# Altium project Stag12.PrjPcb (part 3 of 3)

## Sheet loom-accumulator.SchDoc
size 594 x 420 mm
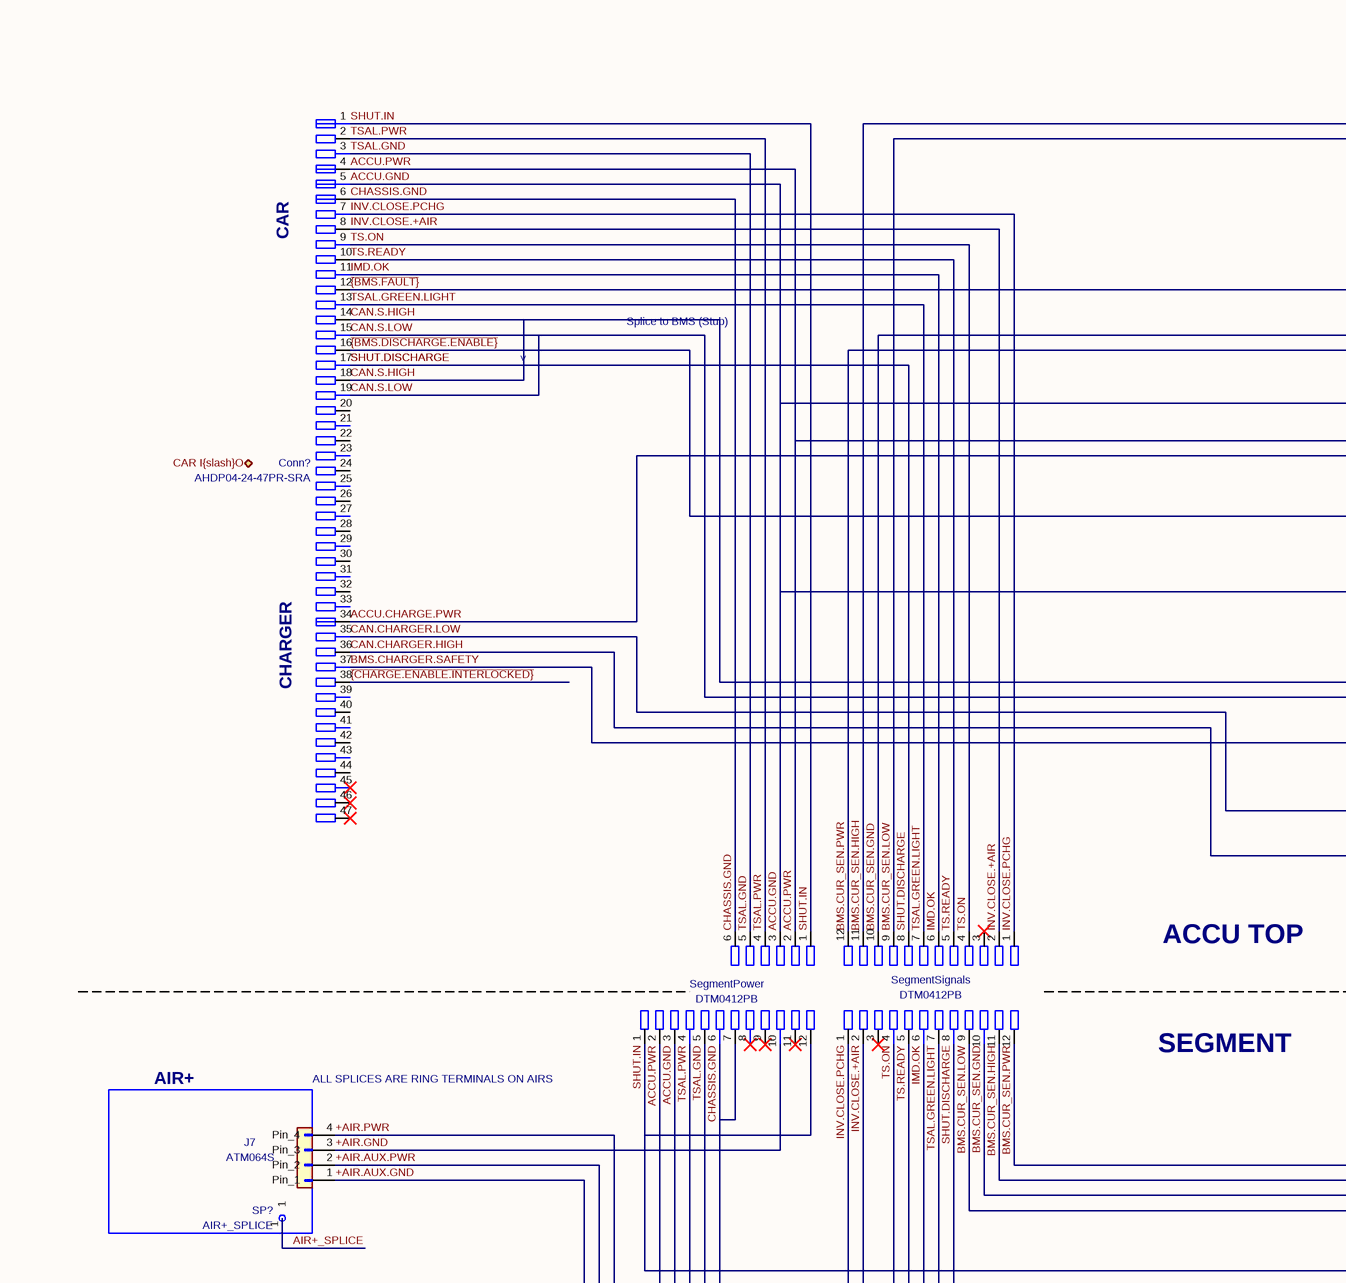
[diagram p44: loom-accumulator.SchDoc, top left]
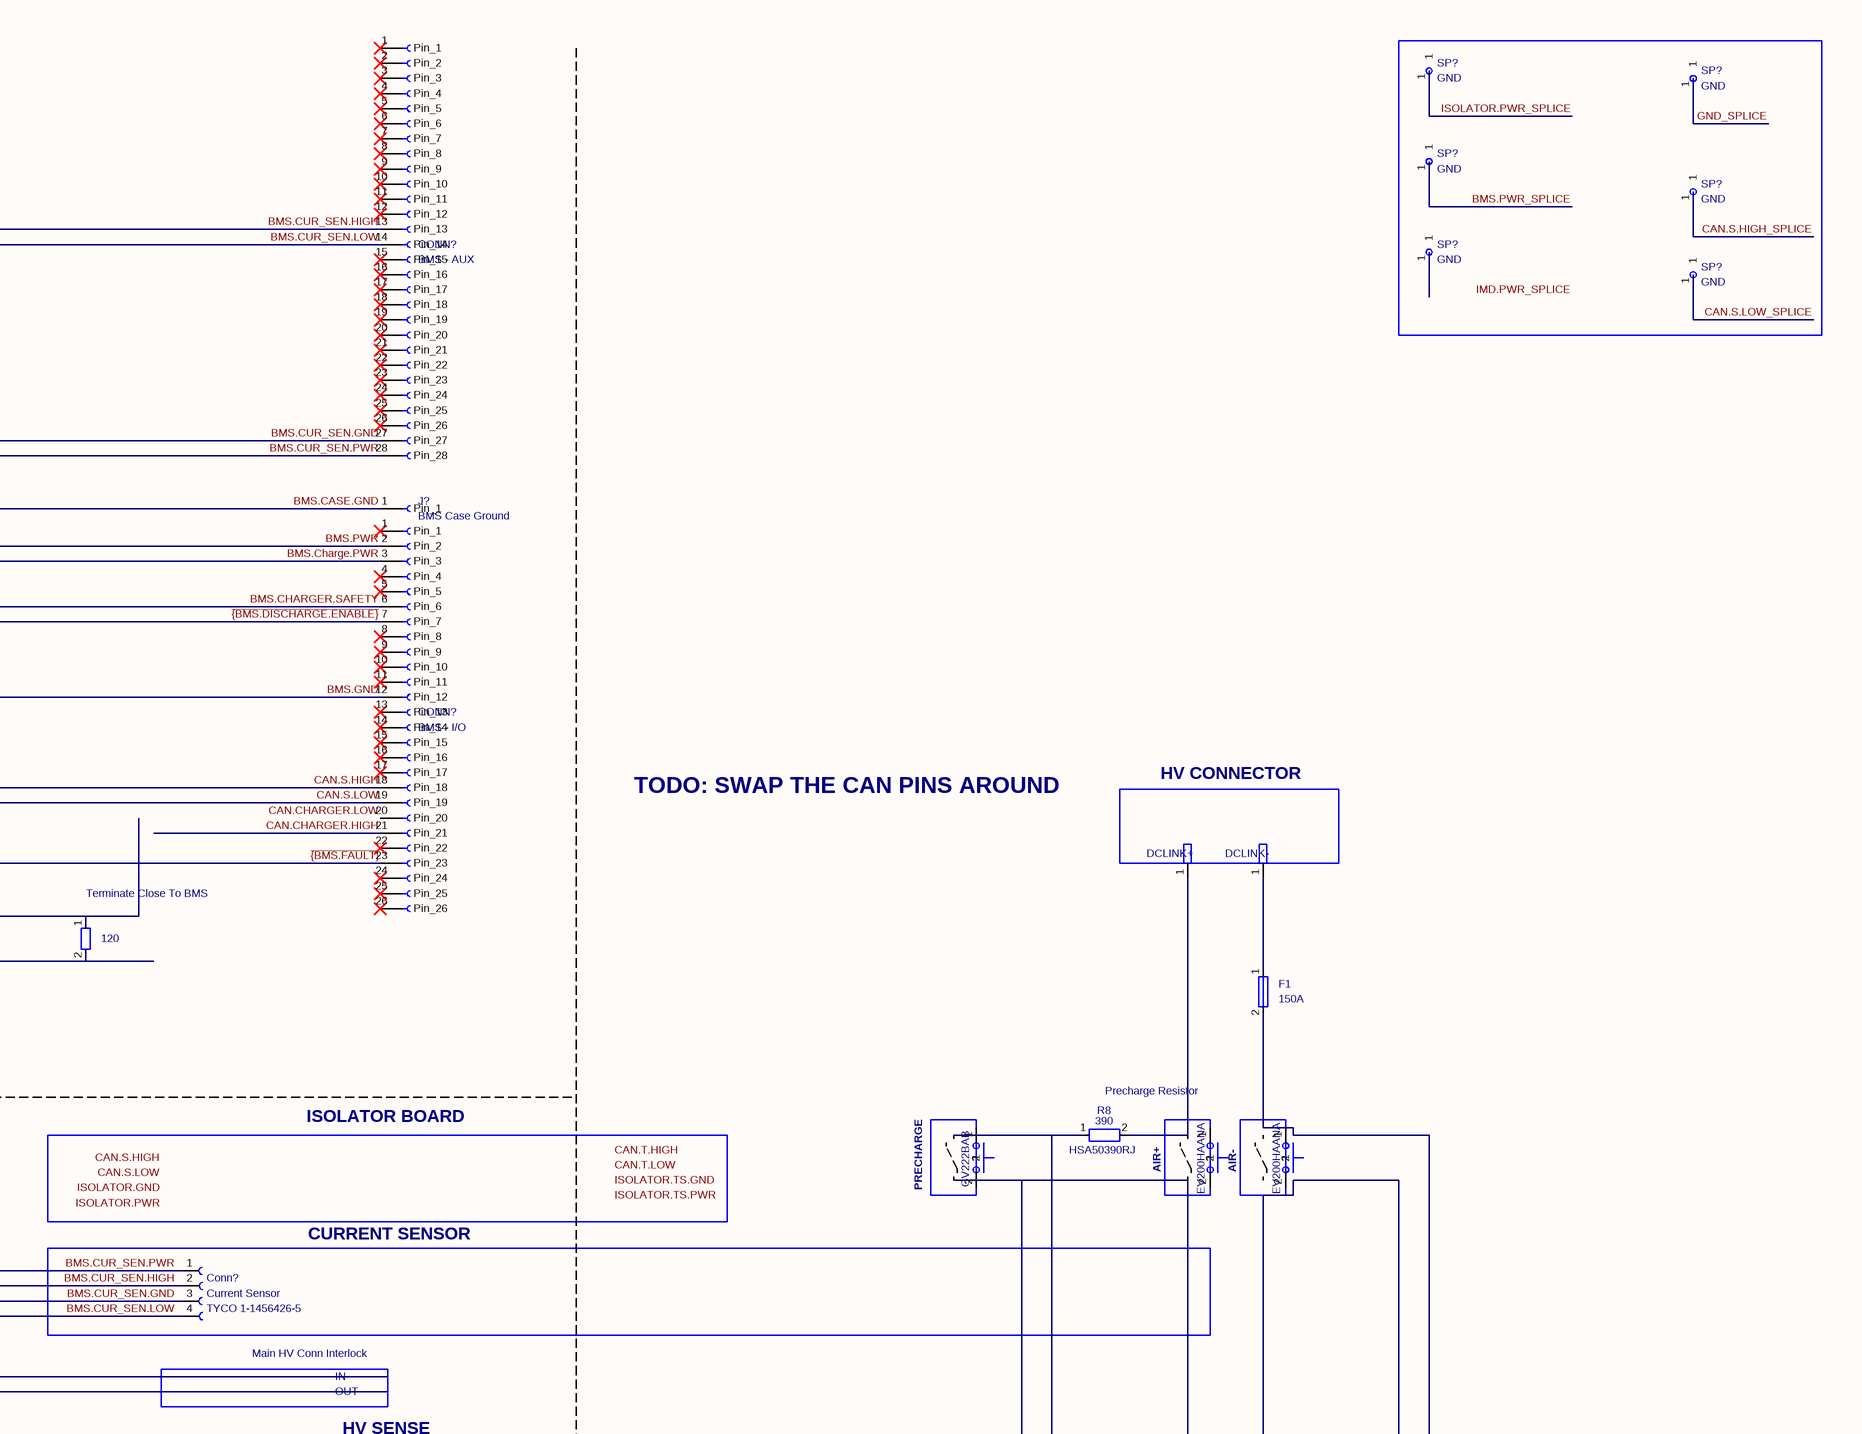
[diagram p45: loom-accumulator.SchDoc, top right]
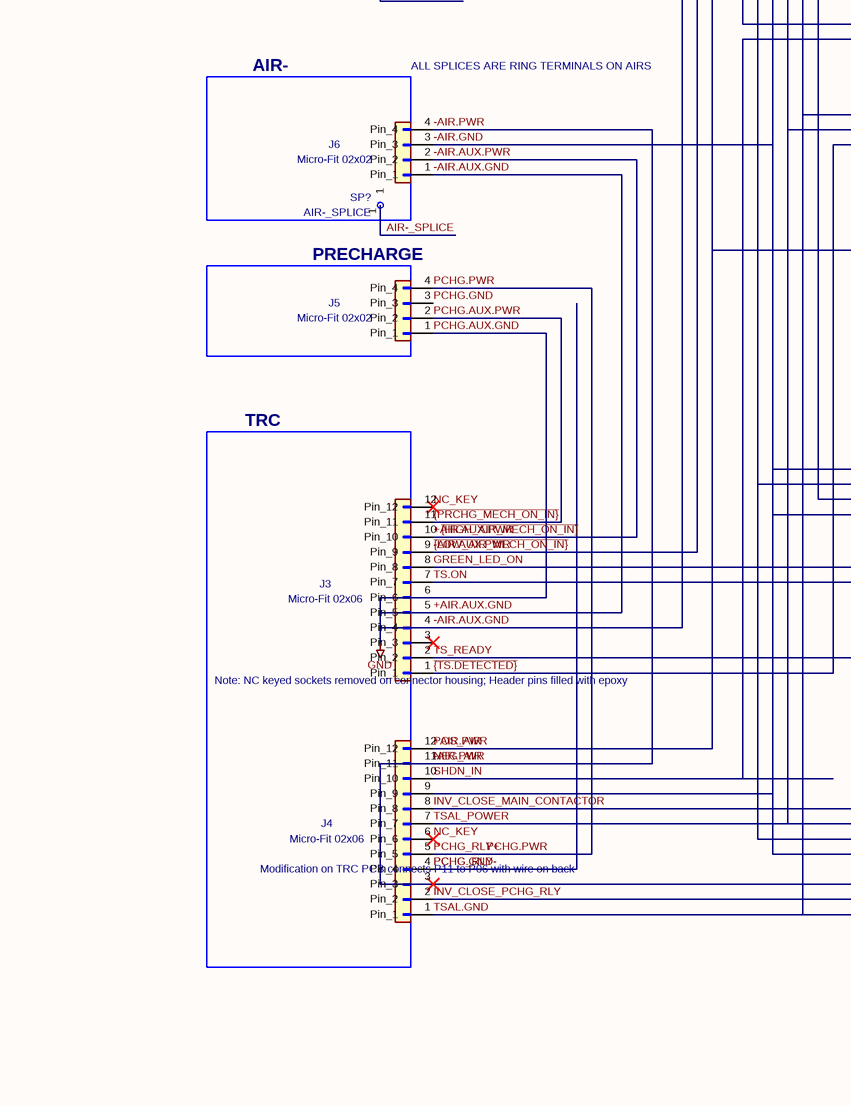
[diagram p46: loom-accumulator.SchDoc, bottom left]
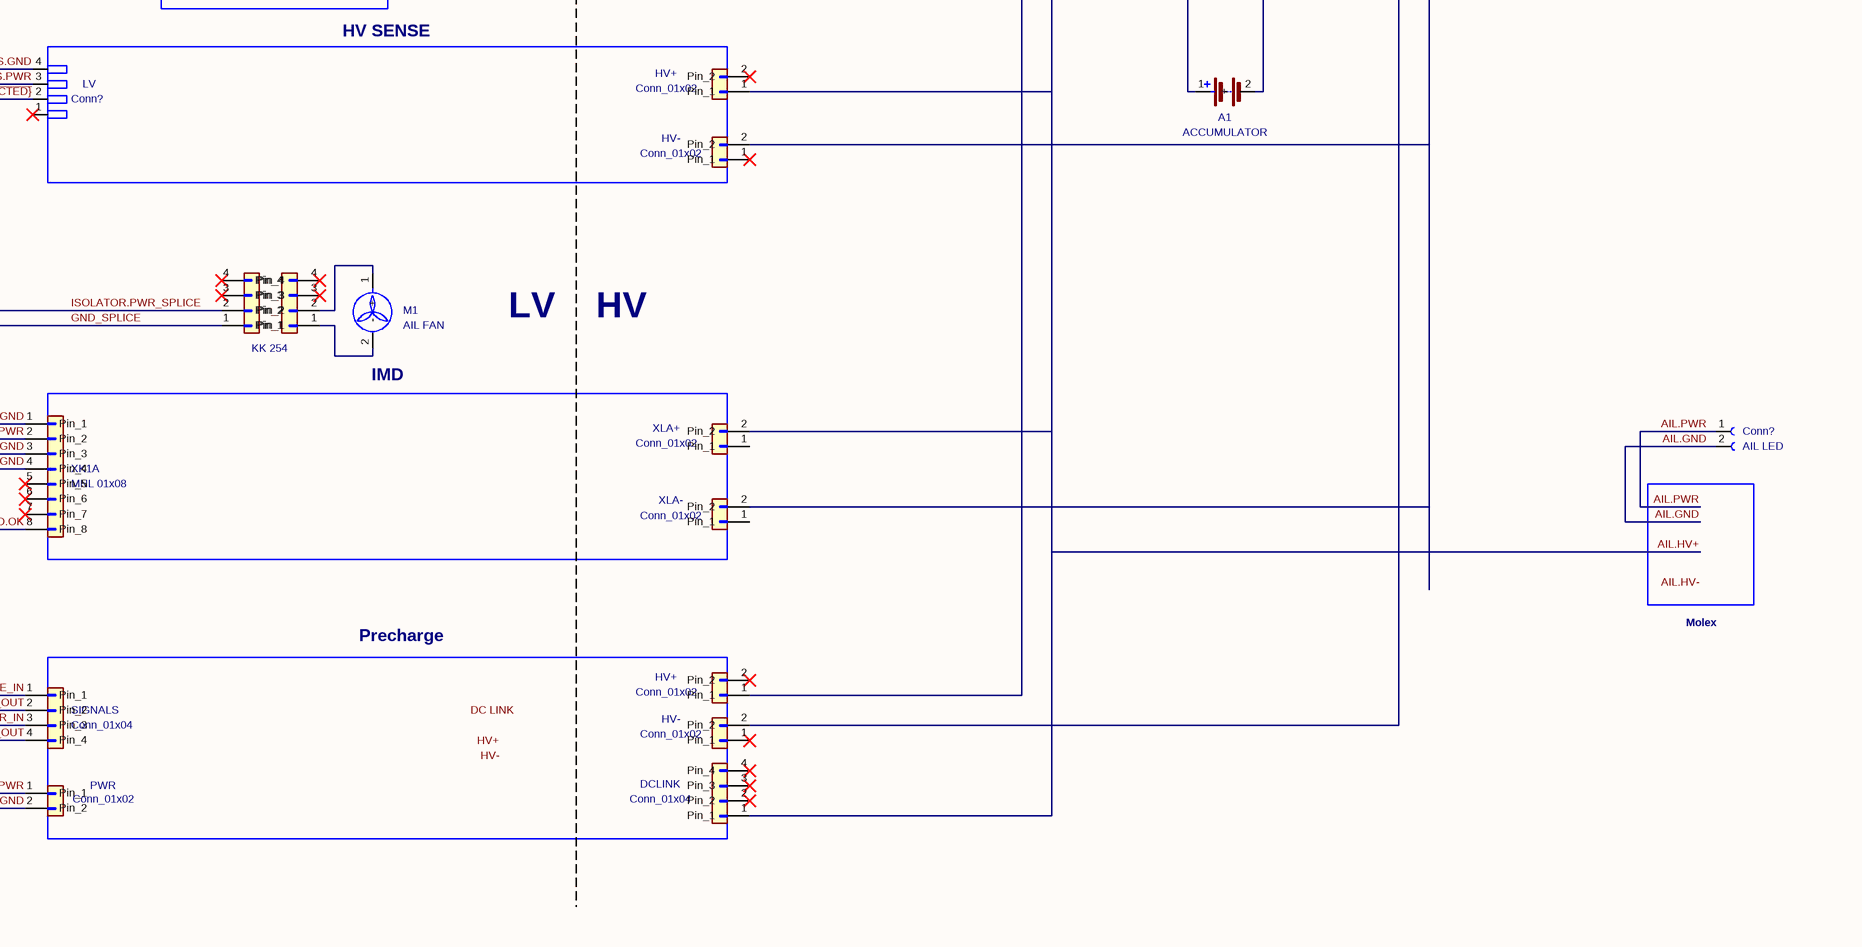
[diagram p47: loom-accumulator.SchDoc, bottom right]

### Parts
(Parts that share a designator on the sheet are numbered #1, #2 ... from top to bottom, then left to right.)
A1  ACCUMULATOR
Conn2  P/N: KK 254  (hidden comment: AIL FAN)
Conn9  Connection Type: DCLINK-  (hidden comment: Banana Plug)
Conn54  AIL FAN  (value not drawn)
Conn?#14  P/N: AHDP04-24-47PR-SRA  (hidden comment: AMPHENOL-47P-Pannel)
CONN?#15  BMS - AUX
CONN?#16  BMS - I/O
Conn?#17  P/N: TYCO 1-1456426-5  (hidden comment: Current Sensor)
Conn?#18  Name: LV  (hidden comment: ~)
Conn?#19  AIL LED
DCLINK  Conn_01x04
DCLINK+  Connection Type: DCLINK+  (hidden comment: Banana Plug)
F1#1  150A
HV+#1  Conn_01x02
HV+#2  Conn_01x02
HV-#1  Conn_01x02
HV-#2  Conn_01x02
J3#2  Micro-Fit 02x06
J4  Micro-Fit 02x06
J5  Micro-Fit 02x02
J6  Micro-Fit 02x02
J7  ATM064S
J?  BMS Case Ground
M1  AIL FAN
PWR  Conn_01x02
R1  120
R8  390  [HSA50390RJ]
SegmentPower  P/N: DTM0412PB  (hidden comment: Deutsch_DTM_12P_Pin)
SegmentPower1  Deutsch_DTM_6P_Pin  (value not drawn)
SegmentSignals  P/N: DTM0412PB  (hidden comment: Deutsch_DTM_12P_Pin)
SegmentSignals1  Deutsch_DTM_12P_Pin  (value not drawn)
SIGNALS  Conn_01x04
SP?#4  GND
SP?#5  GND
SP?#6  GND
SP?#7  GND
SP?#8  GND
SP?#9  GND
SP?#10  AIR+_SPLICE
SP?#11  AIR-_SPLICE
SW7  EV200HAANA
SW8  EV200HAANA
SW9  GV222BAB
XK1A  MNL 01x08
XLA+  Conn_01x02
XLA-  Conn_01x02

### Blocks framed on the sheet
HV CONNECTOR /: Conn9 DCLINK+
AIR+: SP?#10
CURRENT SENSOR /: Conn?#17
AIR-: SP?#11
HV SENSE: Conn?#18
IMD: XK1A
Precharge: PWR SIGNALS

### Ports
CAR I{slash}O (bidir)

### Nets
+AIR.AUX.GND: J3#2.4(Pin_4) J3#2.5(Pin_5) J3#2.6(Pin_6) J5.1(Pin_1) J6.1(Pin_1) J7.1(Pin_1)  [also labelled -AIR.AUX.GND, GND, PCHG.AUX.GND]
+AIR.AUX.PWR: J3#2.9(Pin_9) J3#2.10(Pin_10) J6.2(Pin_2) J7.2(Pin_2)  [also labelled -AIR.AUX.PWR, ~{{HIGH_AIR_MECH_ON_IN}}, ~{{LOW_AIR_MECH_ON_IN}}]
+AIR.GND: Conn2.1(Pin_1) Conn?#14.5 CONN?#16.12(Pin_12) J4.9(Pin_9) J6.3(Pin_3) J7.3(Pin_3) J?.1(Pin_1) PWR.2(Pin_2) SegmentPower.3 SegmentPower.10 SegmentPower1.3 SP?#5.1 XK1A.1(Pin_1) XK1A.4(Pin_4)  [also labelled -AIR.GND, ACCU.GND, BMS.CASE.GND, BMS.GND, GND_SPLICE, IMD.GND, PRECHARGE.GND]
+AIR.PWR: Conn?#14.17 J4.3(Pin_3) J4.11(Pin_11) J4.12(Pin_12) J6.4(Pin_4) J7.4(Pin_4) SegmentSignals.8 SegmentSignals1.8  [also labelled -AIR.PWR, NEG_AIR, POS_AIR, SHUT.DISCHARGE]
ACCU.CHARGE.PWR: Conn?#14.34 CONN?#16.3(Pin_3)  [also labelled BMS.Charge.PWR]
ACCU.PWR: Conn2.2(Pin_2) Conn?#14.4 CONN?#16.2(Pin_2) PWR.1(Pin_1) SegmentPower.2 SegmentPower1.2 SP?#4.1 XK1A.2(Pin_2)  [also labelled BMS.PWR, IMD.PWR, ISOLATOR.PWR_SPLICE, PRECHARGE.PWR]
AIL.GND: Conn?#19.2
AIL.HV+: DCLINK.1(Pin_1) HV+#1.1(Pin_1) R8.1 XLA+.2(Pin_2)
AIL.PWR: Conn?#19.1
AIR+_SPLICE: SP?#10.1
AIR-_SPLICE: SP?#11.1
BMS.CHARGER.SAFETY: Conn?#14.37 CONN?#16.6(Pin_6)
BMS.CUR_SEN.GND: CONN?#15.27(Pin_27) Conn?#17.3 SegmentSignals.10 SegmentSignals1.10
BMS.CUR_SEN.HIGH: CONN?#15.13(Pin_13) Conn?#17.2 SegmentSignals.11 SegmentSignals1.11
BMS.CUR_SEN.LOW: CONN?#15.14(Pin_14) Conn?#17.4 SegmentSignals.9 SegmentSignals1.9
BMS.CUR_SEN.PWR: CONN?#15.28(Pin_28) Conn?#17.1 SegmentSignals.12 SegmentSignals1.12
BMS.PWR_SPLICE: SP?#6.1
CAN.CHARGER.HIGH: Conn?#14.36 CONN?#16.21(Pin_21) R1.2
CAN.CHARGER.LOW: Conn?#14.35 CONN?#16.20(Pin_20) R1.1
CAN.S.HIGH: Conn?#14.14 Conn?#14.18 CONN?#16.18(Pin_18)
CAN.S.HIGH_SPLICE: SP?#7.1
CAN.S.LOW: Conn?#14.15 Conn?#14.19 CONN?#16.19(Pin_19)
CAN.S.LOW_SPLICE: SP?#9.1
CHASSIS.GND: Conn?#14.6 SegmentPower.6 SegmentPower.7 SegmentPower1.6 XK1A.3(Pin_3)
CLOSE_HIGH_AIR_IN: Conn?#14.8 SegmentSignals.2 SegmentSignals1.2 SIGNALS.3(Pin_3)  [also labelled INV.CLOSE.+AIR]
CLOSE_HIGH_AIR_OUT: J4.8(Pin_8) SIGNALS.4(Pin_4)  [also labelled INV_CLOSE_MAIN_CONTACTOR]
CLOSE_PRECHARGE_IN: Conn?#14.7 J4.2(Pin_2) SegmentSignals.1 SegmentSignals1.1 SIGNALS.1(Pin_1) SIGNALS.2(Pin_2)  [also labelled CLOSE_PRECHARGE_OUT, INV.CLOSE.PCHG, INV_CLOSE_PCHG_RLY]
GREEN_LED_ON: Conn?#14.13 J3#2.8(Pin_8) SegmentSignals.7 SegmentSignals1.7  [also labelled TSAL.GREEN.LIGHT]
IMD.OK: Conn?#14.11 SegmentSignals.6 SegmentSignals1.6 XK1A.8(Pin_8)
NC_KEY: J3#2.12(Pin_12) J4.6(Pin_6)
PCHG.AUX.PWR: J3#2.11(Pin_11) J5.2(Pin_2)  [also labelled ~{{PRCHG_MECH_ON_IN}}]
PCHG.GND: J4.4(Pin_4) J5.3(Pin_3)  [also labelled PCHG_RLY-]
PCHG.PWR: J4.5(Pin_5) J5.4(Pin_4)  [also labelled PCHG_RLY+]
SHDN_IN: J4.10(Pin_10)
SHUT.IN: Conn?#14.1 SegmentPower.1 SegmentPower.12 SegmentPower1.1
TS.ON: Conn?#14.9 J3#2.7(Pin_7) SegmentSignals.4 SegmentSignals1.4
TS.READY: Conn?#14.10 J3#2.2(Pin_2) SegmentSignals.5 SegmentSignals1.5  [also labelled TS_READY]
TSAC.HVS.GND: Conn?#14.3 Conn?#18.4 J4.1(Pin_1) SegmentPower.5 SegmentPower1.5  [also labelled TSAL.GND]
TSAC.HVS.PWR: Conn?#14.2 Conn?#18.3 J4.7(Pin_7) SegmentPower.4 SegmentPower1.4  [also labelled TSAL.PWR, TSAL_POWER]
~{{BMS.DISCHARGE.ENABLE}}: Conn?#14.16 CONN?#16.7(Pin_7)
~{{BMS.FAULT}}: Conn?#14.12 CONN?#16.23(Pin_23)
~{{CHARGE.ENABLE.INTERLOCKED}}: Conn?#14.38
~{{TS.DETECTED}}: Conn?#18.2 J3#2.1(Pin_1)
NetA1_1: A1.1(+) HV+#2.1(Pin_1)
NetA1_2: A1.2(-) HV-#2.2(Pin_2)
NetConn9_1: Conn9.1 F1#1.1
NetConn54_1: Conn54.1(Pin_1) M1.2(-)
NetConn54_2: Conn54.2(Pin_2) M1.1(+)
NetDCLINK+_1: DCLINK+.1 R8.2
NetF1#1_2: F1#1.2 HV-#1.2(Pin_2) SW8.1 XLA-.2(Pin_2)

Not connected (* = marked no-connect by the designer): Conn2 3(Pin_3)* 4(Pin_4)*; Conn54 3(Pin_3)* 4(Pin_4)*; Conn?#14 20 21 22 23 24 25 26 27 28 29 30 31 32 33 39 40 41 42 43 44 45* 46* 47*; CONN?#15 1(Pin_1)* 2(Pin_2)* 3(Pin_3)* 4(Pin_4)* 5(Pin_5)* 6(Pin_6)* 7(Pin_7)* 8(Pin_8)* 9(Pin_9)* 10(Pin_10)* 11(Pin_11)* 12(Pin_12)* 15(Pin_15)* 16(Pin_16)* 17(Pin_17)* 18(Pin_18)* 19(Pin_19)* 20(Pin_20)* 21(Pin_21)* 22(Pin_22)* 23(Pin_23)* 24(Pin_24)* 25(Pin_25)* 26(Pin_26)*; CONN?#16 1(Pin_1)* 4(Pin_4)* 5(Pin_5)* 8(Pin_8)* 9(Pin_9)* 10(Pin_10)* 11(Pin_11)* 13(Pin_13)* 14(Pin_14)* 15(Pin_15)* 16(Pin_16)* 17(Pin_17)* 22(Pin_22)* 24(Pin_24)* 25(Pin_25)* 26(Pin_26)*; Conn?#18 1*; DCLINK 2(Pin_2)* 3(Pin_3)* 4(Pin_4)*; HV+#1 2(Pin_2)*; HV+#2 2(Pin_2)*; HV-#1 1(Pin_1)*; HV-#2 1(Pin_1)*; J3#2 3(Pin_3)*; SegmentPower 8* 9* 11*; SegmentSignals 3*; SegmentSignals1 3*; SP?#8 1; SW7 1 2; SW8 2; SW9 1 2; XK1A 5(Pin_5)* 6(Pin_6)* 7(Pin_7)*; XLA+ 1(Pin_1); XLA- 1(Pin_1)

### Notes on the sheet
- (near Conn?#14) CAR
- <--
- Splice to BMS (Stub)
- (near Conn?#14) CHARGER
- TODO: SWAP THE CAN PINS AROUND
- (near R1) Terminate Close
  To BMS
- ACCU TOP
- SEGMENT
- ISOLATOR BOARD
- Precharge Resistor
- (near J7) ALL SPLICES ARE RING
  TERMINALS ON AIRS
- (near SW9) PRECHARGE
- AIR+
- (near SW7) AIR-
- Main HV Conn Interlock
- IN
- OUT
- (near J6) ALL SPLICES ARE RING
  TERMINALS ON AIRS
- PRECHARGE
- LV
- HV
- TRC
- (near J3#2) Note: NC keyed sockets
  removed on connector housing;
  Header pins filled with epoxy
- Molex
- (near J4) Modification on
  TRC PCB connects
  P11 to P06 with
  wire on back
- Labels drawn without touching a wire or pin: AIL.HV-, CAN.S.HIGH, CAN.S.LOW, CAN.T.HIGH, CAN.T.LOW, DC LINK, HV+, HV-, IMD.PWR_SPLICE, ISOLATOR.GND, ISOLATOR.PWR, ISOLATOR.TS.GND, ISOLATOR.TS.PWR
- 1
- 2
- 3
- 4
- 5
- 6
- 7
- 8
- 9
- 10
- 11
- A
- B
- C
- D
- E
- F
- G
- H
- Title: LOOM - ACCUMULATOR
- File: loom-accumulator.kicad_sch
- Sheet: /
- KiCad E.D.A.  kicad (5.1.4)-1
- Size: A2
- Date:
- Rev:
- Id: 1/1

### Library data of the parts
A1 = Battery: Description: Multiple-cell battery; Value: ACCUMULATOR
Conn2 DCLINK J5-J7 SIGNALS = Conn_01x04: Description: Generic connector, single row, 01x04, script generated (kicad-library-utils/schlib/autogen/connector/)
  Conn2: Value: AIL FAN
  DCLINK SIGNALS: Value: Conn_01x04
  J5 J6: Value: Micro-Fit 02x02
  J7: Value: ATM064S
Conn54 = Conn_01x04: Description: Generic connector, single row, 01x04, script generated (kicad-library-utils/schlib/autogen/connector/); P/N: KK 254; Value: AIL FAN
CONN?#15 = Conn_01x28_Socket: Value: BMS - AUX
CONN?#16 = Conn_01x26_Socket: Value: BMS - I/O
Conn?#17 = Current Sensor Connector: Value: Current Sensor
Conn?#18 = Molex_2x2P_Horizontal_1: P/N: 43045-0400; Value: ~
Conn?#19 = Molex_2x1S_Recepticle: P/N: 43645-0200; Value: AIL LED
F1#1 = Fuse: Description: Fuse; Value: 150A
HV+#1 HV+#2 HV-#1 HV-#2 PWR XLA+ XLA- = Conn_01x02: Description: Generic connector, single row, 01x02, script generated (kicad-library-utils/schlib/autogen/connector/); Value: Conn_01x02
J3#2 J4 = Conn_01x12: Description: Generic connector, single row, 01x12, script generated (kicad-library-utils/schlib/autogen/connector/); Value: Micro-Fit 02x06
J? = Conn_01x01_Socket: Description: Generic connector, single row, 01x01, script generated; Value: BMS Case Ground
M1 = Fan: Description: Fan; Value: AIL FAN
R1 = R_Small: Description: Resistor, small symbol; Value: 120
R8 = R: Description: Resistor; Value: 390
SegmentPower1 = Deutsch_DTM_6P_Pin: P/N: DTM046P-E003; Value: Deutsch_DTM_6P_Pin
SegmentSignals1 = Deutsch_DTM_12P_Pin: P/N: DTM0412PB; Value: Deutsch_DTM_12P_Pin
SP?#4-SP?#11 = TestPoint_Small
  SP?#4-SP?#9: Value: GND
  SP?#10: Value: AIR+_SPLICE
  SP?#11: Value: AIR-_SPLICE
SW7-SW9 = SW_Push: Description: Push button switch, generic, two pins
  SW7 SW8: Value: EV200HAANA
  SW9: Value: GV222BAB
XK1A = Conn_01x08: Description: Generic connector, single row, 01x08, script generated (kicad-library-utils/schlib/autogen/connector/); Value: MNL 01x08
Conn9 DCLINK+ = Banana Plug: Value: Banana Plug
Conn?#14 = AMPHENOL-47P-Pannel: Value: AMPHENOL-47P-Pannel
SegmentPower SegmentSignals = Deutsch_DTM_12P_Pin: Value: Deutsch_DTM_12P_Pin

## Sheet pinouts.SchDoc
size 297 x 209 mm
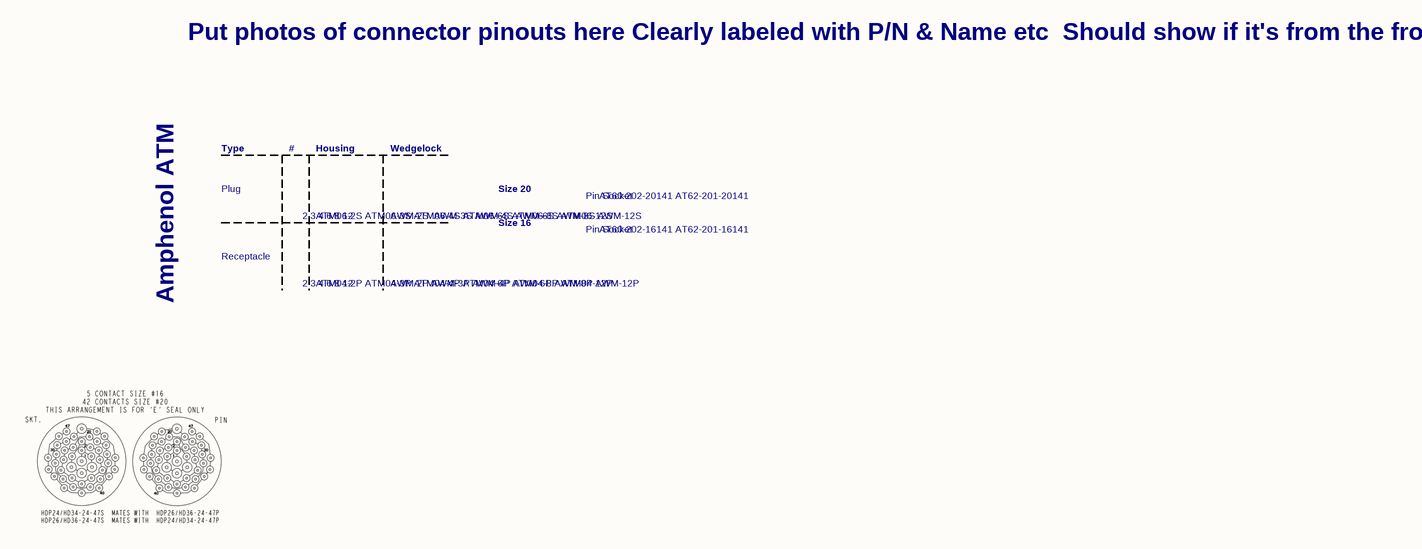
[diagram p48: pinouts.SchDoc]

### Notes on the sheet
- Put photos of connector pinouts here
  Clearly labeled with P/N & Name etc
  Should show if it's from the front or the back
- Type
- #
- Housing
- Wedgelock
- Plug
- 2
  3
  4
  6
  8
  12
- ATM06-2S
  ATM06-3S
  ATM06-4S
  ATM06-6S
  ATM06-8S
  ATM06-12S
- AWM-2S
  AWM-3S
  AWM-4S
  AWM-6S
  AWM-8S
  AWM-12S
- Size 20
- Size 16
- Pin
  Socket
- AT60-202-20141
  AT62-201-20141
- AT60-202-16141
  AT62-201-16141
- Amphenol ATM
- Receptacle
- ATM04-2P
  ATM04-3P
  ATM04-4P
  ATM04-6P
  ATM04-8P
  ATM04-12P
- AWM-2P
  AWM-3P
  AWM-4P
  AWM-6P
  AWM-8P
  AWM-12P
- 1
- 2
- 3
- 4
- 5
- 6
- A
- B
- C
- D
- Title: MISC  - PINOUTS
- File: pinouts.kicad_sch
- Sheet: /
- KiCad E.D.A.  kicad (5.1.4)-1
- Size: A4
- Date:
- Rev:
- Id: 1/1

## Sheet loom-umbilical-box.SchDoc
size 297 x 209 mm
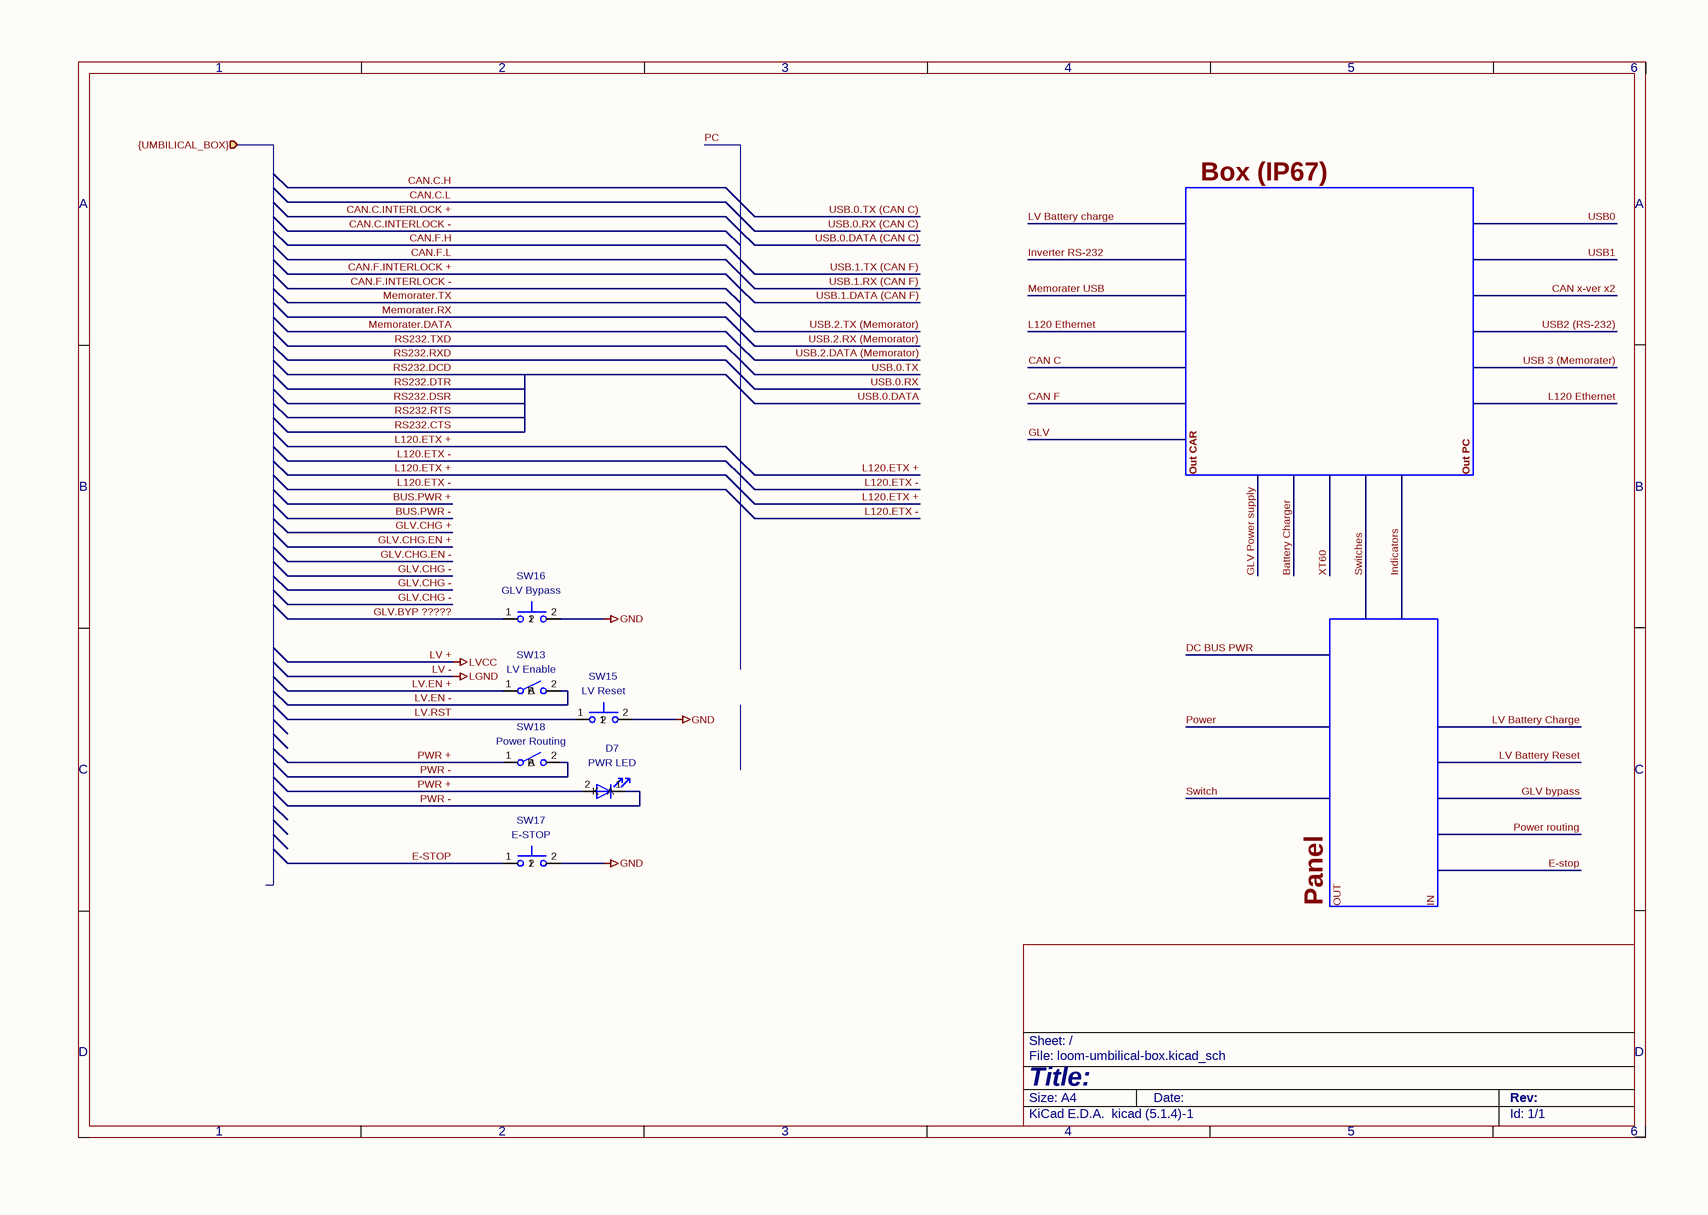
[diagram p49: loom-umbilical-box.SchDoc]

### Parts
(Parts that share a designator on the sheet are numbered #1, #2 ... from top to bottom, then left to right.)
D7  PWR LED
SW13#2  LV Enable
SW15  LV Reset
SW16  GLV Bypass
SW17  E-STOP
SW18  Power Routing

### Ports
{UMBILICAL_BOX} (in)

### Nets
GND: SW15.2 SW16.2 SW17.2  [project net +AIR.AUX.GND]
E-stop: SW17.1
GLV.BYP ?????: SW16.1
LV.EN +: SW13#2.1(A)
LV.EN -: SW13#2.2(B)
LV.RST: SW15.1
PWR +: D7.2(A) SW18.1(A)
PWR -: D7.1(K) SW18.2(B)

### Buses and harness runs
bus PC

### Notes on the sheet
- Labels drawn without touching a wire or pin: Box (IP67), IN, OUT, Out CAR, Out PC, Panel
- 1
- 2
- 3
- 4
- 5
- 6
- A
- B
- C
- D
- Title:
- File: loom-umbilical-box.kicad_sch
- Sheet: /
- KiCad E.D.A.  kicad (5.1.4)-1
- Size: A4
- Date:
- Rev:
- Id: 1/1

### Library data of the parts
D7 = LED: Description: Light emitting diode; Sim.Pins: 1=K 2=A; Value: PWR LED
SW13#2 SW18 = SW_SPST: Description: Single Pole Single Throw (SPST) switch
  SW13#2: Value: LV Enable
  SW18: Value: Power Routing
SW15-SW17 = SW_Push: as SW7-SW9 on sheet loom-accumulator
  SW15: Value: LV Reset
  SW16: Value: GLV Bypass
  SW17: Value: E-STOP

## Sheet device-lvbms.SchDoc
size 297 x 209 mm
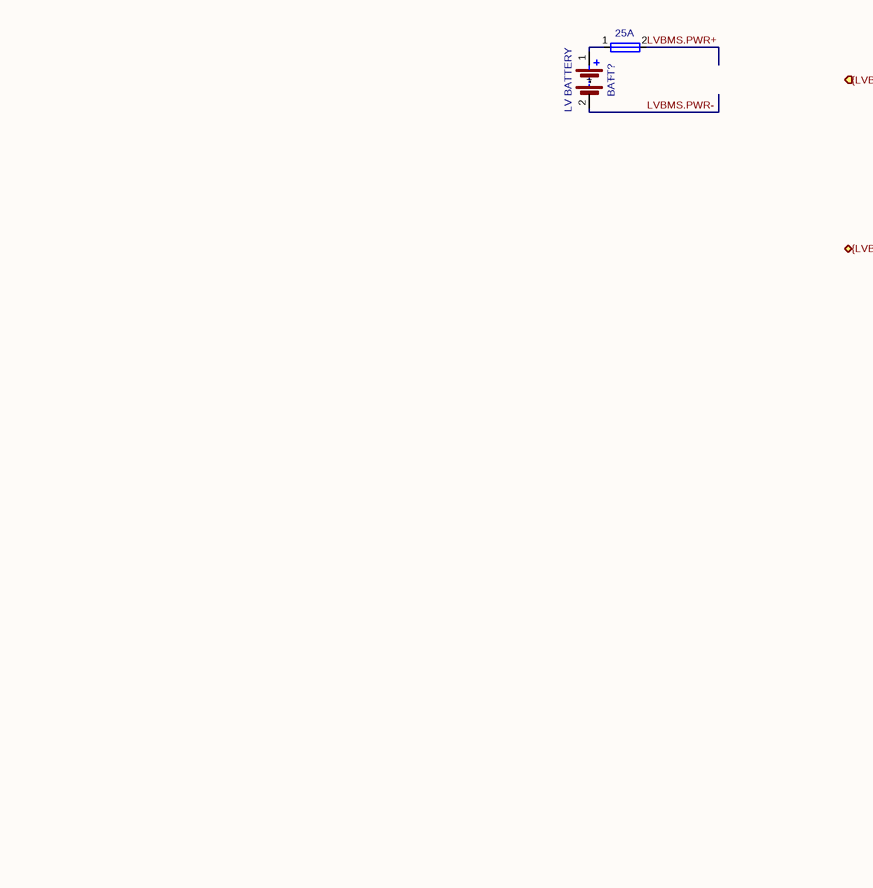
[diagram p50: device-lvbms.SchDoc]

### Parts
BATT?  Conn Name: LV BATTERY  (hidden comment: ~)
F?  25A

### Ports
{LVBMS.DATA} (bidir), {LVBMS.PWR} (in)

### Nets
LVBMS.PWR+: F?.2
LVBMS.PWR-: BATT?.2(-)
NetBATT?_1: BATT?.1(+) F?.1

### Notes on the sheet
- 1
- 2
- 3
- 4
- 5
- 6
- A
- B
- C
- D
- Title:
- File: device-lvbms.kicad_sch
- Sheet: /
- KiCad E.D.A.  kicad (5.1.4)-1
- Size: A4
- Date:
- Rev:
- Id: 1/1

### Library data of the parts
BATT? = Battery: Value: ~
F? = Fuse: Value: 25A

## Sheet loom-pedal-box.SchDoc
size 594 x 420 mm
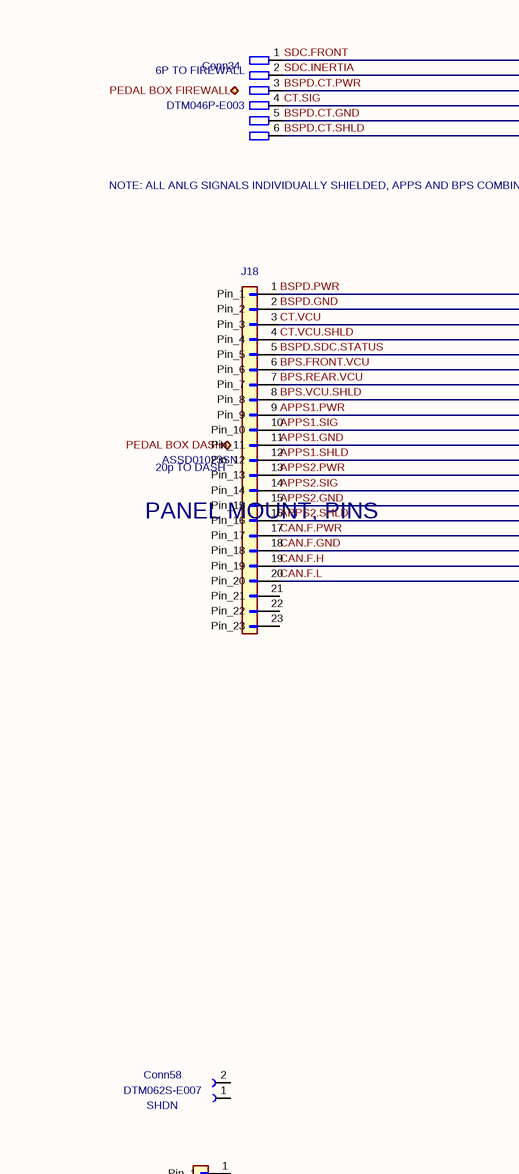
[diagram p51: loom-pedal-box.SchDoc, top left]
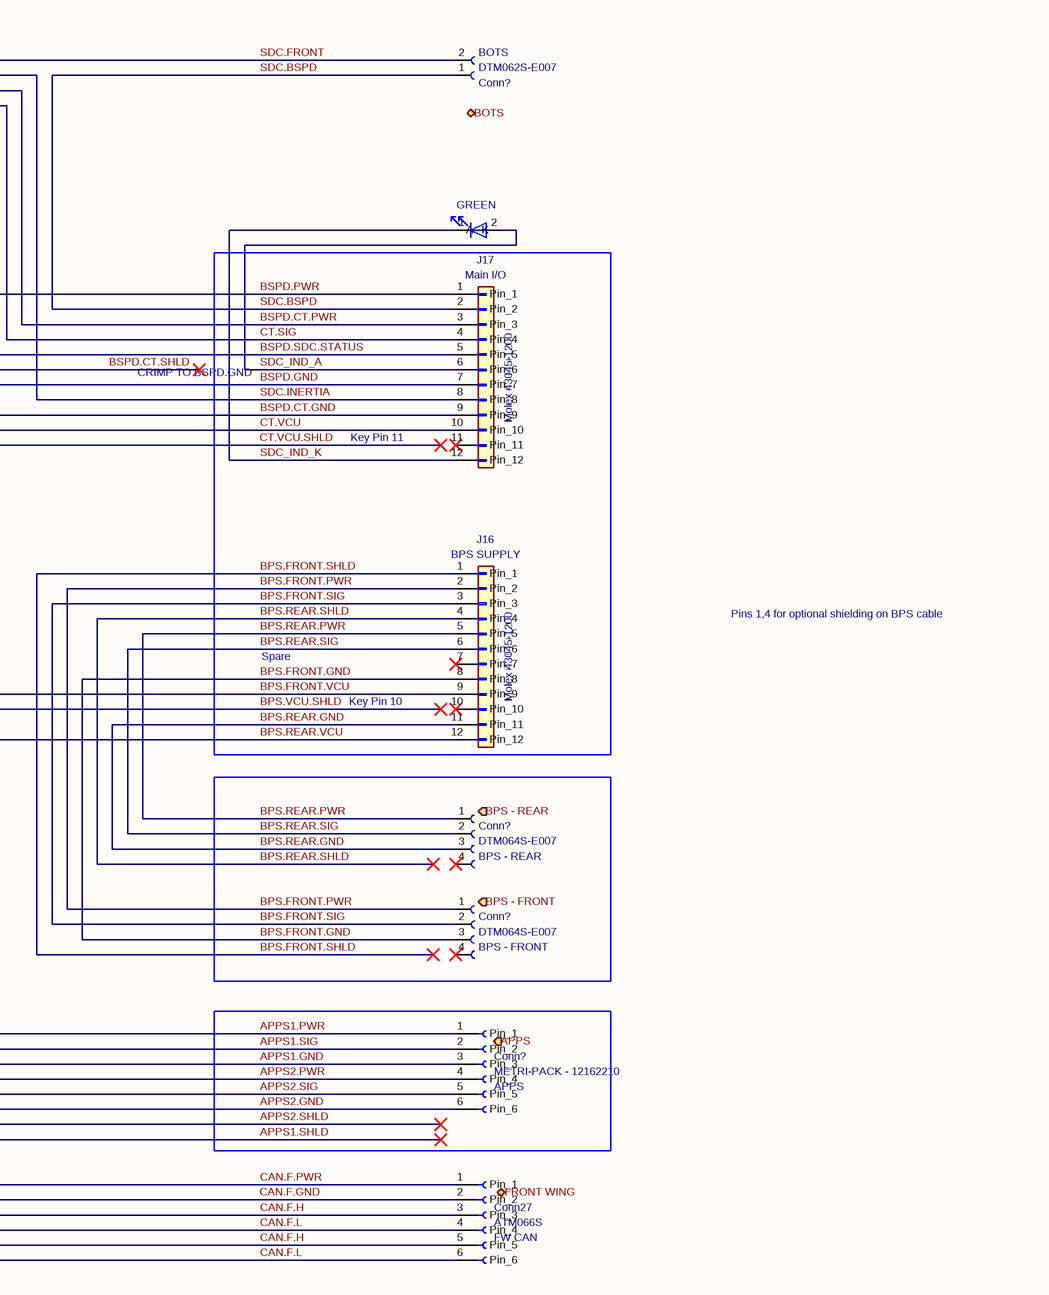
[diagram p52: loom-pedal-box.SchDoc, top right]
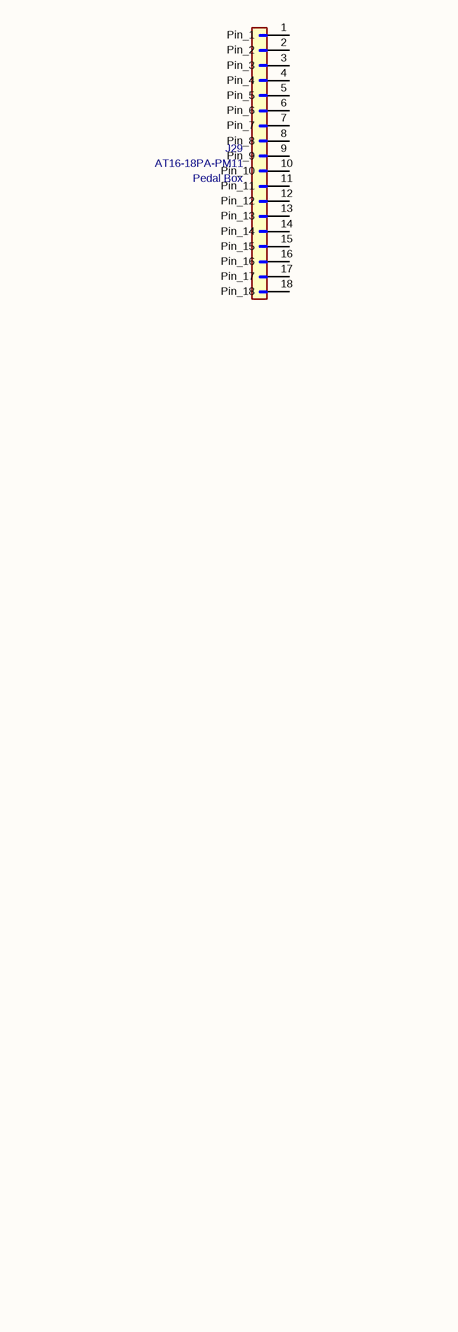
[diagram p53: loom-pedal-box.SchDoc, bottom left]
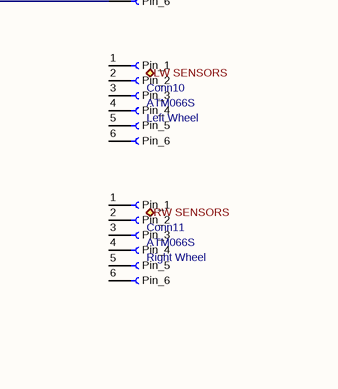
[diagram p54: loom-pedal-box.SchDoc, bottom right]

### Parts
(Parts that share a designator on the sheet are numbered #1, #2 ... from top to bottom, then left to right.)
Conn10  Conn Name: Left Wheel  (hidden comment: ATM066S)
Conn11  Conn Name: Right Wheel  (hidden comment: ATM066S)
Conn27  Conn Name: FW CAN  (hidden comment: ATM066S)
Conn34  P/N: DTM046P-E003  (hidden comment: Deutsch_DTM_6P_Pin)
Conn58  P/N: DTM062S-E007  Conn Name: SHDN  (hidden comment: Deutsch_DTM_2S_Pin)
Conn?#20  P/N: DTM062S-E007  Conn Name: BOTS  (hidden comment: Deutsch_DTM_2S_Pin)
Conn?#21  P/N: DTM064S-E007  Conn Name: BPS - REAR  (hidden comment: Deutsch_DTM_4S_Pin)
Conn?#22  P/N: DTM064S-E007  Conn Name: BPS - FRONT  (hidden comment: Deutsch_DTM_4S_Pin)
Conn?#23  Conn Name: APPS  (hidden comment: METRI-PACK - 12162210)
D6  GREEN
J16  P/N: Molex 43045-1200  [Molex_Micro-Fit_3.0_43045-1200_2x06_P3.00mm_Horizontal]  (hidden comment: BPS SUPPLY)
J17  P/N: Molex 43045-1200  [Molex_Micro-Fit_3.0_43045-1200_2x06_P3.00mm_Horizontal]  (hidden comment: Main I/O)
J18  ASSD01023SN
J29  Conn Name: Pedal Box  (hidden comment: AT16-18PA-PM11)

### Ports
APPS (in), BOTS (bidir), BPS - FRONT (in), BPS - REAR (in), FRONT WING (bidir), LW SENSORS (bidir), PEDAL BOX DASH (bidir), PEDAL BOX FIREWALL (bidir), RW SENSORS (bidir)

### Nets
APPS1.GND: Conn?#23.3(Pin_3) J18.11(Pin_11)
APPS1.PWR: Conn?#23.1(Pin_1) J18.9(Pin_9)
APPS1.SHLD: J18.12(Pin_12)
APPS1.SIG: Conn?#23.2(Pin_2) J18.10(Pin_10)
APPS2.GND: Conn?#23.6(Pin_6) J18.15(Pin_15)
APPS2.PWR: Conn?#23.4(Pin_4) J18.13(Pin_13)
APPS2.SHLD: J18.16(Pin_16)
APPS2.SIG: Conn?#23.5(Pin_5) J18.14(Pin_14)
BPS.FRONT.GND: Conn?#22.3 J16.8(Pin_8)
BPS.FRONT.PWR: Conn?#22.1 J16.2(Pin_2)
BPS.FRONT.SHLD: J16.1(Pin_1)
BPS.FRONT.SIG: Conn?#22.2 J16.3(Pin_3)
BPS.FRONT.VCU: J16.9(Pin_9) J18.6(Pin_6)
BPS.REAR.GND: Conn?#21.3 J16.11(Pin_11)
BPS.REAR.PWR: Conn?#21.1 J16.5(Pin_5)
BPS.REAR.SHLD: J16.4(Pin_4)
BPS.REAR.SIG: Conn?#21.2 J16.6(Pin_6)
BPS.REAR.VCU: J16.12(Pin_12) J18.7(Pin_7)
BPS.VCU.SHLD: J18.8(Pin_8)
BSPD.CT.GND: Conn34.5 J17.9(Pin_9)
BSPD.CT.PWR: Conn34.3 J17.3(Pin_3)
BSPD.CT.SHLD: Conn34.6
BSPD.GND: J17.7(Pin_7) J18.2(Pin_2)
BSPD.PWR: J17.1(Pin_1) J18.1(Pin_1)
BSPD.SDC.STATUS: J17.5(Pin_5) J18.5(Pin_5)
CAN.F.GND: Conn27.2(Pin_2) J18.18(Pin_18)
CAN.F.H: Conn27.3(Pin_3) Conn27.5(Pin_5) J18.19(Pin_19)
CAN.F.L: Conn27.4(Pin_4) Conn27.6(Pin_6) J18.20(Pin_20)
CAN.F.PWR: Conn27.1(Pin_1) J18.17(Pin_17)
CT.SIG: Conn34.4 J17.4(Pin_4)
CT.VCU: J17.10(Pin_10) J18.3(Pin_3)
CT.VCU.SHLD: J18.4(Pin_4)
SDC.BSPD: Conn?#20.1 J17.2(Pin_2)
SDC.FRONT: Conn34.1 Conn?#20.2
SDC.INERTIA: Conn34.2 J17.8(Pin_8)
SDC_IND_A: D6.2(A) J17.6(Pin_6)
SDC_IND_K: D6.1(K) J17.12(Pin_12)

Not connected (* = marked no-connect by the designer): Conn10 1(Pin_1) 2(Pin_2) 3(Pin_3) 4(Pin_4) 5(Pin_5) 6(Pin_6); Conn11 1(Pin_1) 2(Pin_2) 3(Pin_3) 4(Pin_4) 5(Pin_5) 6(Pin_6); Conn58 1 2; Conn?#21 4*; Conn?#22 4*; J16 7(Pin_7)* 10(Pin_10)*; J17 11(Pin_11)*; J18 21(Pin_21) 22(Pin_22) 23(Pin_23); J29 1(Pin_1) 2(Pin_2) 3(Pin_3) 4(Pin_4) 5(Pin_5) 6(Pin_6) 7(Pin_7) 8(Pin_8) 9(Pin_9) 10(Pin_10) 11(Pin_11) 12(Pin_12) 13(Pin_13) 14(Pin_14) 15(Pin_15) 16(Pin_16) 17(Pin_17) 18(Pin_18)

### Notes on the sheet
- (near Conn34) 6P TO FIREWALL
- (near Conn34) NOTE: ALL ANLG SIGNALS
  INDIVIDUALLY SHIELDED,
  APPS AND BPS COMBINED
  AT CONNECTOR WITH FLY
  WIRE TO MINI PDM.
  CT.SIG HAS DEDICATED
  SHIELD TO MINI PDM
- CRIMP TO BSPD.GND
- (near J18) 20p TO DASH
- Key Pin 11
- (near J18) PANEL MOUNT,
  PINS
- Pins 1,4 for
  optional shielding
  on BPS cable
- Spare
- Key Pin 10
- 1
- 2
- 3
- 4
- 5
- 6
- 7
- 8
- 9
- 10
- 11
- A
- B
- C
- D
- E
- F
- G
- H
- Title: LOOM - PEDAL BOX
- File: loom-pedal-box.kicad_sch
- Sheet: /
- KiCad E.D.A.  kicad (5.1.4)-1
- Size: A2
- Date:
- Rev:
- Id: 1/1

### Library data of the parts
Conn10 Conn11 Conn27 Conn?#23 = Conn_01x06_Socket
  Conn10 Conn11 Conn27: Value: ATM066S
  Conn?#23: Value: METRI-PACK - 12162210
D6 = LED: as D7 on sheet loom-umbilical-box; Value: GREEN
J16 J17 = Conn_01x12: Description: Generic connector, single row, 01x12, script generated (kicad-library-utils/schlib/autogen/connector/); To Order: INV; Footprint: Connector_Molex:Molex_Micro-Fit_3.0_43045-1200_2x06_P3.00mm_Horizontal
  J16: Value: BPS SUPPLY
  J17: Value: Main I/O
J18 = Conn_01x23: Description: Generic connector, single row, 01x23, script generated (kicad-library-utils/schlib/autogen/connector/); Value: ASSD01023SN
J29 = Conn_01x18: Description: Generic connector, single row, 01x18, script generated (kicad-library-utils/schlib/autogen/connector/); Value: AT16-18PA-PM11
Conn34 = Deutsch_DTM_6P_Pin: Value: Deutsch_DTM_6P_Pin
Conn58 Conn?#20 = Deutsch_DTM_2S_Pin: Value: Deutsch_DTM_2S_Pin
Conn?#21 Conn?#22 = Deutsch_DTM_4S_Pin: Value: Deutsch_DTM_4S_Pin

## Sheet device-fsuk_datalogger.SchDoc
size 297 x 209 mm
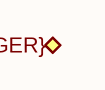
[diagram p55: device-fsuk_datalogger.SchDoc]

### Ports
{FSUK_DATALOGGER} (bidir)

### Notes on the sheet
- 1
- 2
- 3
- 4
- 5
- 6
- A
- B
- C
- D
- Title:
- File: device-fsuk_datalogger.kicad_sch
- Sheet: /
- KiCad E.D.A.  kicad (5.1.4)-1
- Size: A4
- Date:
- Rev:
- Id: 1/1

## Sheet device-brake-light.SchDoc
size 297 x 209 mm
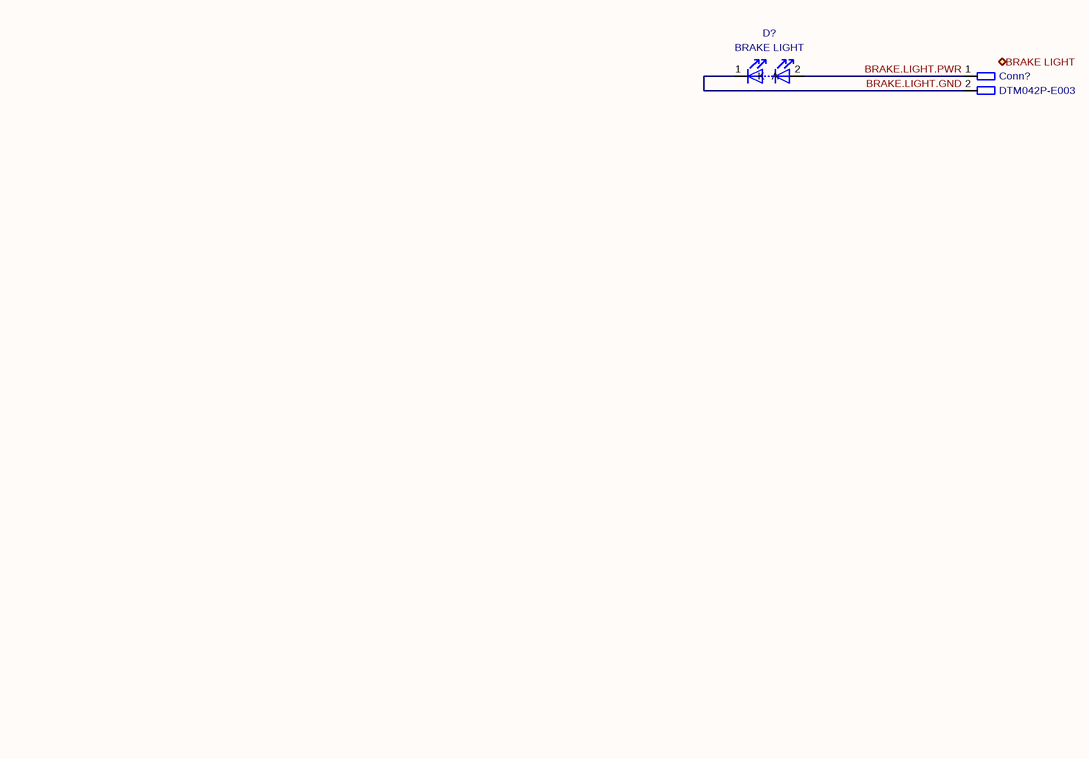
[diagram p56: device-brake-light.SchDoc]

### Parts
(Parts that share a designator on the sheet are numbered #1, #2 ... from top to bottom, then left to right.)
Conn?#24  P/N: DTM042P-E003  (hidden comment: Deutsch_DTM_2P_Pin)
D?#5  BRAKE LIGHT

### Ports
BRAKE LIGHT (bidir)

### Nets
BRAKE.LIGHT.GND: Conn?#24.2 D?#5.1(K)
BRAKE.LIGHT.PWR: Conn?#24.1 D?#5.2(A)

### Notes on the sheet
- 1
- 2
- 3
- 4
- 5
- 6
- A
- B
- C
- D
- Title: LOOM - BRAKE LIGHT
- File: device-brake-light.kicad_sch
- Sheet: /
- KiCad E.D.A.  kicad (5.1.4)-1
- Size: A4
- Date:
- Rev:
- Id: 1/1

### Library data of the parts
D?#5 = LED_Series: Value: BRAKE LIGHT
Conn?#24 = Deutsch_DTM_2P_Pin: Value: Deutsch_DTM_2P_Pin

## Sheet loom-dash-box.SchDoc
size 420 x 297 mm
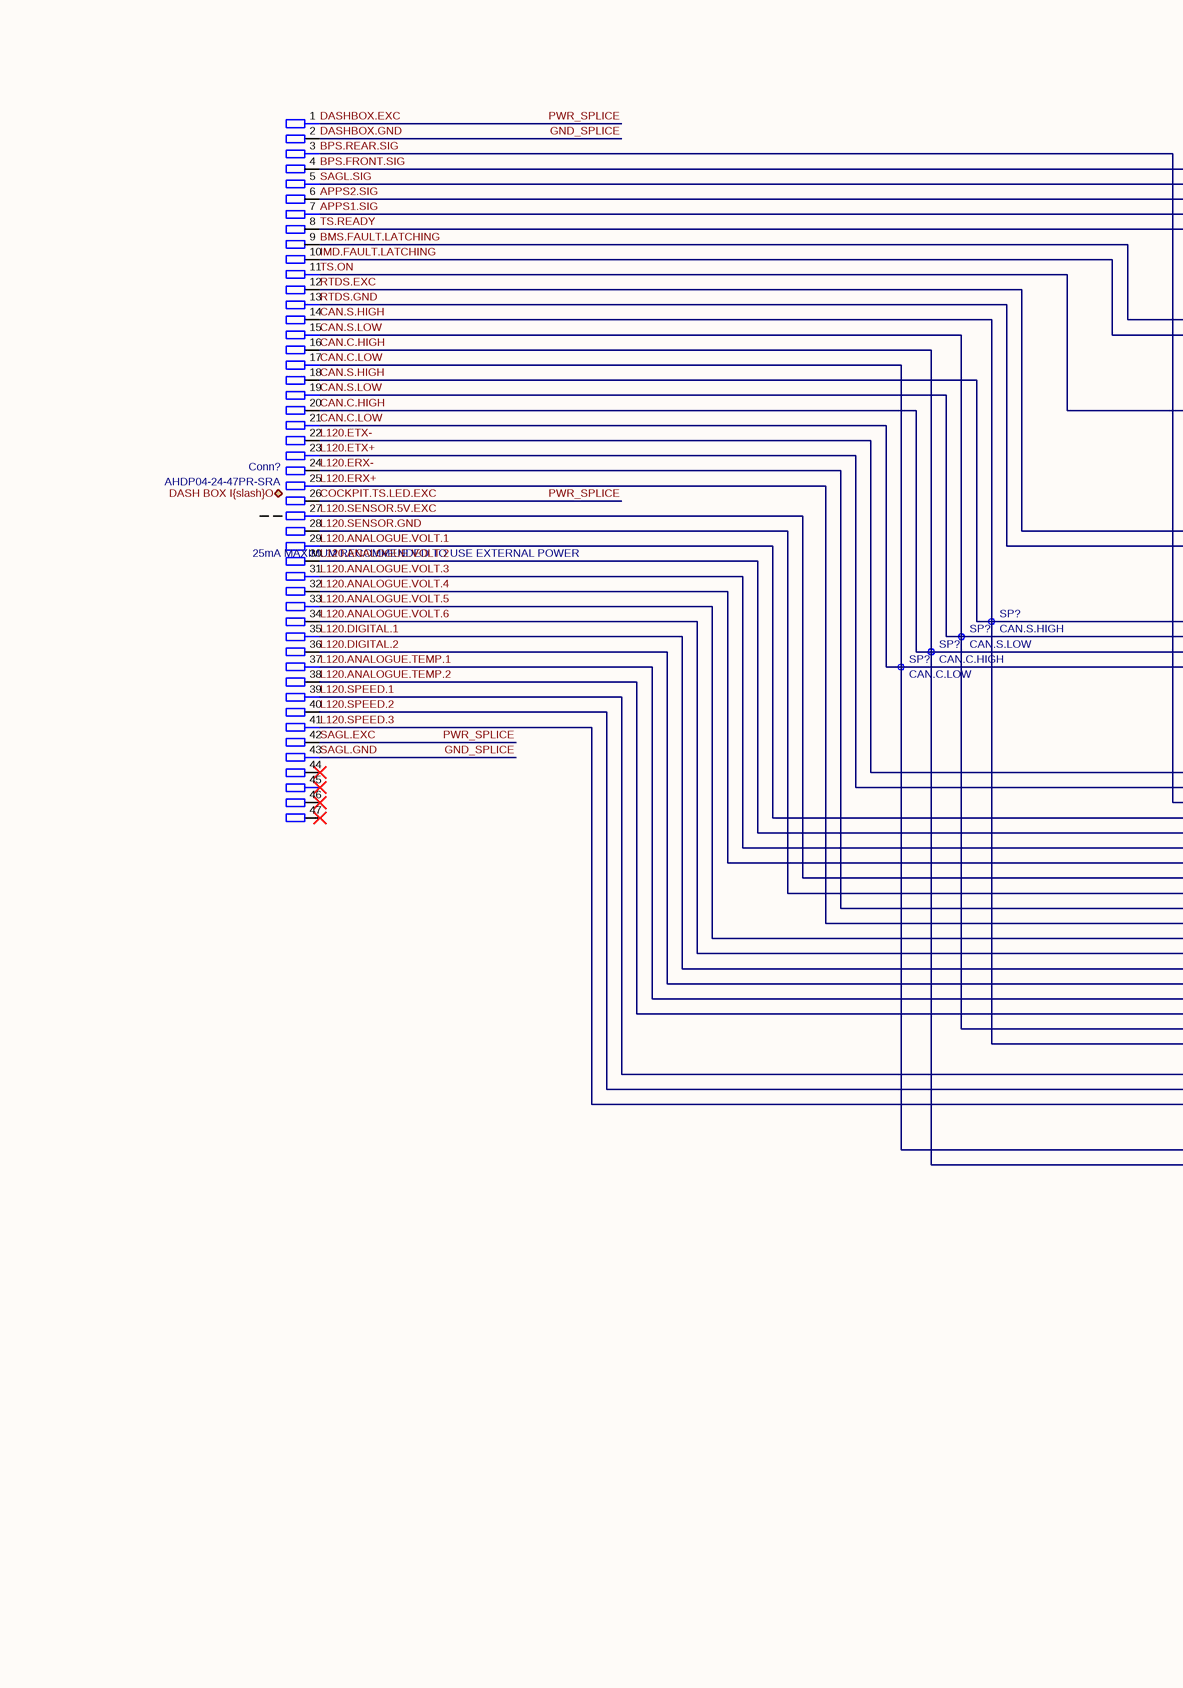
[diagram p57: loom-dash-box.SchDoc, left]
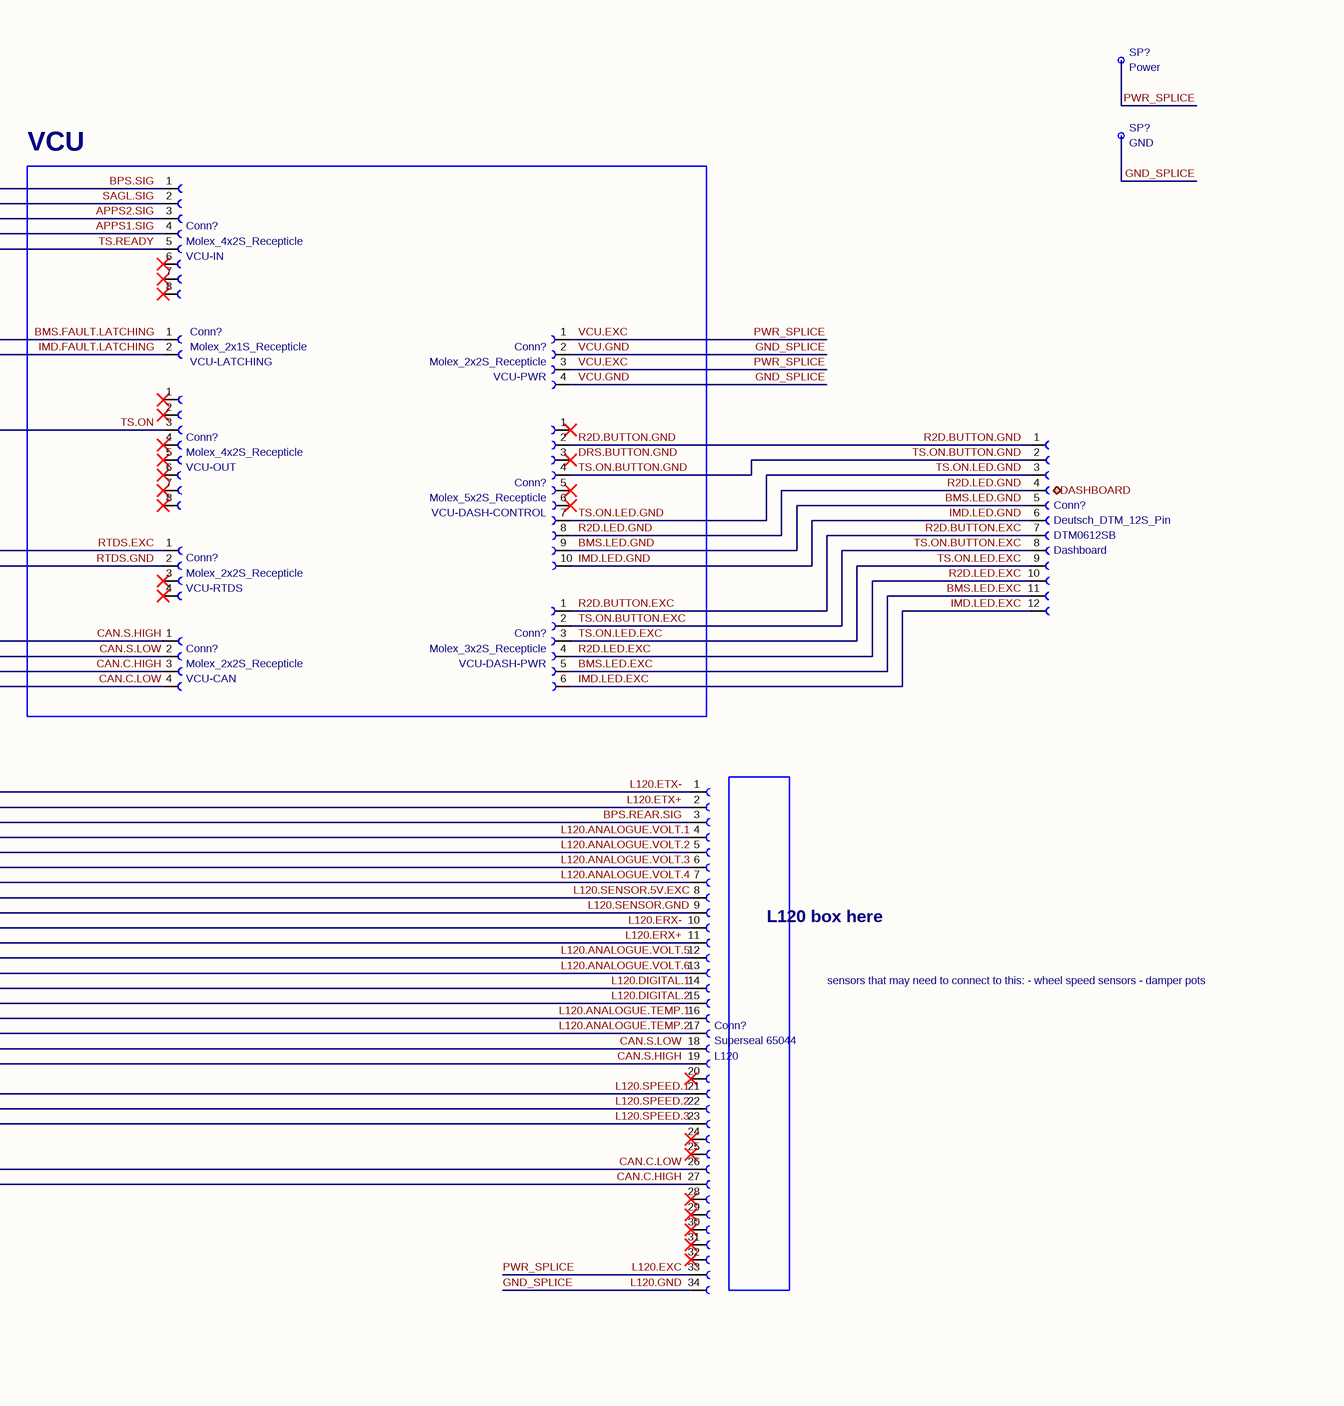
[diagram p58: loom-dash-box.SchDoc, right]

### Parts
(Parts that share a designator on the sheet are numbered #1, #2 ... from top to bottom, then left to right.)
Conn?#25  P/N: AHDP04-24-47PR-SRA  (hidden comment: AMPHENOL-47P-Pannel)
Conn?#26  Conn Name: VCU-IN  (hidden comment: Molex_4x2S_Recepticle)
Conn?#27  Conn Name: VCU-PWR  (hidden comment: Molex_2x2S_Recepticle)
Conn?#28  Conn Name: VCU-LATCHING  (hidden comment: Molex_2x1S_Recepticle)
Conn?#29  Conn Name: VCU-OUT  (hidden comment: Molex_4x2S_Recepticle)
Conn?#30  Conn Name: VCU-DASH-CONTROL  (hidden comment: Molex_5x2S_Recepticle)
Conn?#31  Conn Name: VCU-RTDS  (hidden comment: Molex_2x2S_Recepticle)
Conn?#32  Conn Name: VCU-DASH-PWR  (hidden comment: Molex_3x2S_Recepticle)
Conn?#33  Conn Name: VCU-CAN  (hidden comment: Molex_2x2S_Recepticle)
Conn?#34  P/N: DTM0612SB  Conn Name: Dashboard  (hidden comment: Deutsch_DTM_12S_Pin)
Conn?#35  P/N: Superseal 65044  Conn Name: L120  (hidden comment: L120 Connector)
SP?#12  Power
SP?#13  GND
SP?#14  CAN.S.HIGH
SP?#15  CAN.S.LOW
SP?#16  CAN.C.HIGH
SP?#17  CAN.C.LOW

### Blocks framed on the sheet
VCU: Conn?#26-Conn?#33

### Ports
DASH BOX I{slash}O (bidir), DASHBOARD (bidir)

### Nets
APPS1.SIG: Conn?#25.7 Conn?#26.4
APPS2.SIG: Conn?#25.6 Conn?#26.3
BMS.FAULT.LATCHING: Conn?#25.9 Conn?#28.1
BMS.LED.EXC: Conn?#32.5 Conn?#34.11
BMS.LED.GND: Conn?#30.9 Conn?#34.5
BPS.FRONT.SIG: Conn?#25.4 Conn?#26.1  [also labelled BPS.SIG]
BPS.REAR.SIG: Conn?#25.3 Conn?#35.3
CAN.C.HIGH: Conn?#25.16 Conn?#25.20 Conn?#33.3 Conn?#35.27 SP?#16.1
CAN.C.LOW: Conn?#25.17 Conn?#25.21 Conn?#33.4 Conn?#35.26 SP?#17.1
CAN.S.HIGH: Conn?#25.14 Conn?#25.18 Conn?#33.1 Conn?#35.19 SP?#14.1
CAN.S.LOW: Conn?#25.15 Conn?#25.19 Conn?#33.2 Conn?#35.18 SP?#15.1
COCKPIT.TS.LED.EXC: Conn?#25.1 Conn?#25.26 Conn?#25.42 Conn?#27.1 Conn?#27.3 Conn?#35.33 SP?#12.1  [also labelled DASHBOX.EXC, L120.EXC, PWR_SPLICE, SAGL.EXC, VCU.EXC]
DASHBOX.GND: Conn?#25.2 Conn?#25.43 Conn?#27.2 Conn?#27.4 Conn?#35.34 SP?#13.1  [also labelled GND_SPLICE, L120.GND, SAGL.GND, VCU.GND]
IMD.FAULT.LATCHING: Conn?#25.10 Conn?#28.2
IMD.LED.EXC: Conn?#32.6 Conn?#34.12
IMD.LED.GND: Conn?#30.10 Conn?#34.6
L120.ANALOGUE.TEMP.1: Conn?#25.37 Conn?#35.16
L120.ANALOGUE.TEMP.2: Conn?#25.38 Conn?#35.17
L120.ANALOGUE.VOLT.1: Conn?#25.29 Conn?#35.4
L120.ANALOGUE.VOLT.2: Conn?#25.30 Conn?#35.5
L120.ANALOGUE.VOLT.3: Conn?#25.31 Conn?#35.6
L120.ANALOGUE.VOLT.4: Conn?#25.32 Conn?#35.7
L120.ANALOGUE.VOLT.5: Conn?#25.33 Conn?#35.12
L120.ANALOGUE.VOLT.6: Conn?#25.34 Conn?#35.13
L120.DIGITAL.1: Conn?#25.35 Conn?#35.14
L120.DIGITAL.2: Conn?#25.36 Conn?#35.15
L120.ERX+: Conn?#25.25 Conn?#35.11
L120.ERX-: Conn?#25.24 Conn?#35.10
L120.ETX+: Conn?#25.23 Conn?#35.2
L120.ETX-: Conn?#25.22 Conn?#35.1
L120.SENSOR.5V.EXC: Conn?#25.27 Conn?#35.8
L120.SENSOR.GND: Conn?#25.28 Conn?#35.9
L120.SPEED.1: Conn?#25.39 Conn?#35.21
L120.SPEED.2: Conn?#25.40 Conn?#35.22
L120.SPEED.3: Conn?#25.41 Conn?#35.23
R2D.BUTTON.EXC: Conn?#32.1 Conn?#34.7
R2D.BUTTON.GND: Conn?#30.2 Conn?#34.1
R2D.LED.EXC: Conn?#32.4 Conn?#34.10
R2D.LED.GND: Conn?#30.8 Conn?#34.4
RTDS.EXC: Conn?#25.12 Conn?#31.1
RTDS.GND: Conn?#25.13 Conn?#31.2
SAGL.SIG: Conn?#25.5 Conn?#26.2
TS.ON: Conn?#25.11 Conn?#29.3
TS.ON.BUTTON.EXC: Conn?#32.2 Conn?#34.8
TS.ON.BUTTON.GND: Conn?#30.4 Conn?#34.2
TS.ON.LED.EXC: Conn?#32.3 Conn?#34.9
TS.ON.LED.GND: Conn?#30.7 Conn?#34.3
TS.READY: Conn?#25.8 Conn?#26.5

Not connected (* = marked no-connect by the designer): Conn?#25 44* 45* 46* 47*; Conn?#26 6* 7* 8*; Conn?#29 1* 2* 4* 5* 6* 7* 8*; Conn?#30 1* 3* 5* 6*; Conn?#31 3* 4*; Conn?#35 20* 24* 25* 28* 29* 30* 31* 32*

### Notes on the sheet
- (near Conn?#25) 25mA MAXIMUM
  RECOMMENDED
  TO USE EXTERNAL
  POWER
- L120 box here
- sensors that may need to connect to this:
  - wheel speed sensors
  - damper pots
- Labels drawn without touching a wire or pin: DRS.BUTTON.GND
- 1
- 2
- 3
- 4
- 5
- 6
- 7
- 8
- A
- B
- C
- D
- E
- Title: LOOM - DASH BOX
- File: loom-dash-box.kicad_sch
- Sheet: /
- F
- KiCad E.D.A.  kicad (5.1.4)-1
- Size: A3
- Date:
- Rev:
- Id: 1/1

### Library data of the parts
Conn?#26 Conn?#29 = Molex_4x2S_Recepticle: P/N: 43025-0800; Value: Molex_4x2S_Recepticle
Conn?#27 Conn?#31 Conn?#33 = Molex_2x2S_Recepticle: P/N: 43025-0400; Value: Molex_2x2S_Recepticle
Conn?#28 = Molex_2x1S_Recepticle: P/N: 43645-0200; Value: Molex_2x1S_Recepticle
Conn?#30 = Molex_5x2S_Recepticle: P/N: 43025-1000; Value: Molex_5x2S_Recepticle
Conn?#32 = Molex_3x2S_Recepticle: P/N: 43025-0600; Value: Molex_3x2S_Recepticle
SP?#12-SP?#17 = TestPoint_Small
  SP?#12: Value: Power
  SP?#13: Value: GND
  SP?#14: Value: CAN.S.HIGH
  SP?#15: Value: CAN.S.LOW
  SP?#16: Value: CAN.C.HIGH
  SP?#17: Value: CAN.C.LOW
Conn?#25 = AMPHENOL-47P-Pannel: Value: AMPHENOL-47P-Pannel
Conn?#34 = Deutsch_DTM_12S_Pin: Value: Deutsch_DTM_12S_Pin
Conn?#35 = L120 Connector: Value: L120 Connector

## Sheet loom-dummy-accumulator.SchDoc
size 297 x 209 mm
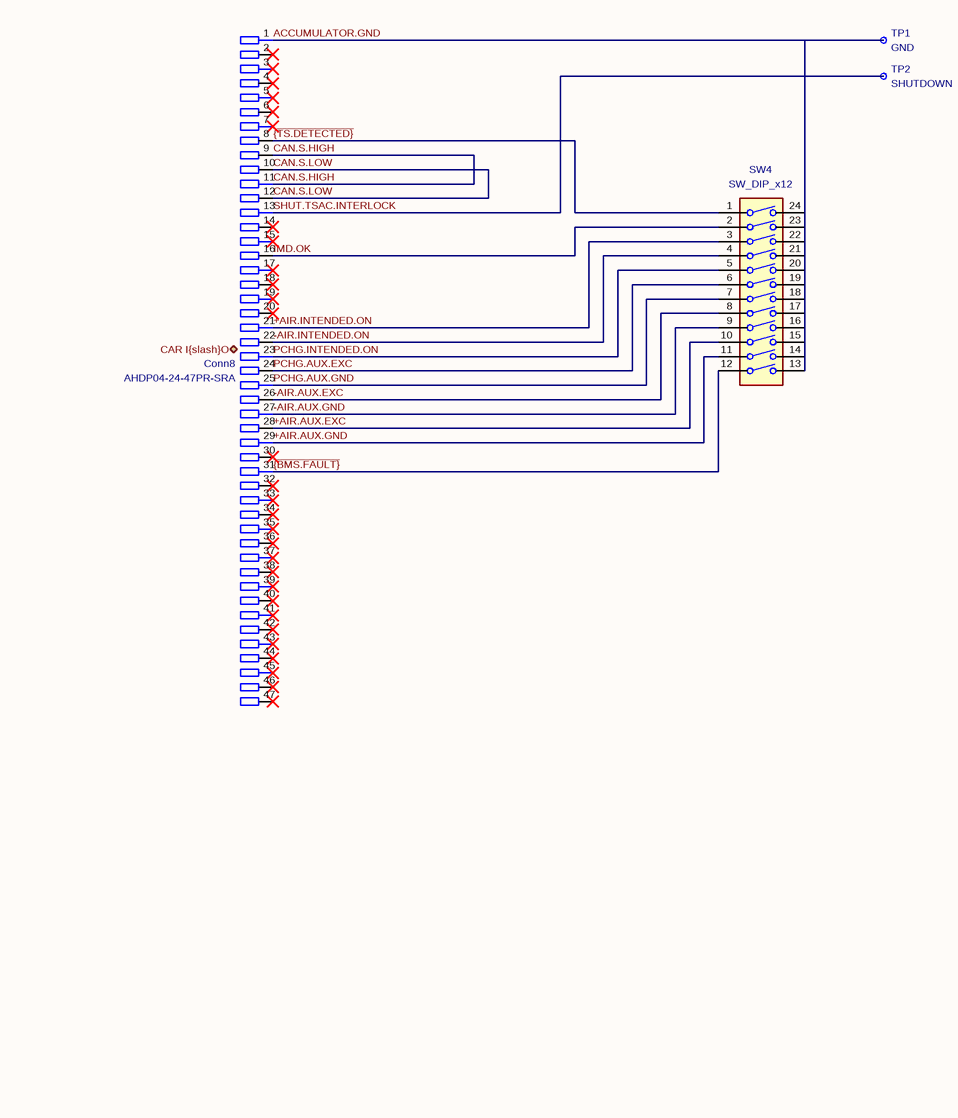
[diagram p59: loom-dummy-accumulator.SchDoc]

### Parts
(Parts that share a designator on the sheet are numbered #1, #2 ... from top to bottom, then left to right.)
Conn8#2  P/N: AHDP04-24-47PR-SRA  (hidden comment: AMPHENOL-47P-Pannel)
SW4#2  SW_DIP_x12
TP1  GND
TP2  SHUTDOWN

### Ports
CAR I{slash}O (bidir)

### Nets
+AIR.AUX.EXC: Conn8#2.28 SW4#2.10
+AIR.AUX.GND: Conn8#2.29 SW4#2.11
+AIR.INTENDED.ON: Conn8#2.21 SW4#2.3
-AIR.AUX.EXC: Conn8#2.26 SW4#2.8
-AIR.AUX.GND: Conn8#2.27 SW4#2.9
-AIR.INTENDED.ON: Conn8#2.22 SW4#2.4
ACCUMULATOR.GND: Conn8#2.1 SW4#2.13 SW4#2.14 SW4#2.15 SW4#2.16 SW4#2.17 SW4#2.18 SW4#2.19 SW4#2.20 SW4#2.21 SW4#2.22 SW4#2.23 SW4#2.24 TP1.1
CAN.S.HIGH: Conn8#2.9 Conn8#2.11
CAN.S.LOW: Conn8#2.10 Conn8#2.12
IMD.OK: Conn8#2.16 SW4#2.2
PCHG.AUX.EXC: Conn8#2.24 SW4#2.6
PCHG.AUX.GND: Conn8#2.25 SW4#2.7
PCHG.INTENDED.ON: Conn8#2.23 SW4#2.5
SHUT.TSAC.INTERLOCK: Conn8#2.13 TP2.1
~{{BMS.FAULT}}: Conn8#2.31 SW4#2.12
~{{TS.DETECTED}}: Conn8#2.8 SW4#2.1

Not connected (* = marked no-connect by the designer): Conn8#2 2* 3* 4* 5* 6* 7* 14* 15* 17* 18* 19* 20* 30* 32* 33* 34* 35* 36* 37* 38* 39* 40* 41* 42* 43* 44* 45* 46* 47*

### Notes on the sheet
- 1
- 2
- 3
- 4
- 5
- 6
- A
- B
- C
- D
- Title: LOOM - DUMMY ACCUMULATOR
- File: loom-dummy-accumulator.kicad_sch
- Sheet: /
- KiCad E.D.A.  kicad (5.1.4)-1
- Size: A4
- Date:
- Rev:
- Id: 1/1

### Library data of the parts
SW4#2 = SW_DIP_x12: Description: 12x DIP Switch, Single Pole Single Throw (SPST) switch, small symbol; Value: SW_DIP_x12
TP1 TP2 = TestPoint_Small: Description: test point
  TP1: Value: GND
  TP2: Value: SHUTDOWN
Conn8#2 = AMPHENOL-47P-Pannel: Value: AMPHENOL-47P-Pannel

## Sheet loom-roll-hoop.SchDoc
size 297 x 209 mm

### Notes on the sheet
- 1
- 2
- 3
- 4
- 5
- 6
- A
- B
- C
- D
- Title: LOOM - ROLL HOOP
- File: loom-roll-hoop.kicad_sch
- Sheet: /
- KiCad E.D.A.  kicad (5.1.4)-1
- Size: A4
- Date:
- Rev:
- Id: 1/1

## Sheet loom-side-panel.SchDoc
size 297 x 209 mm
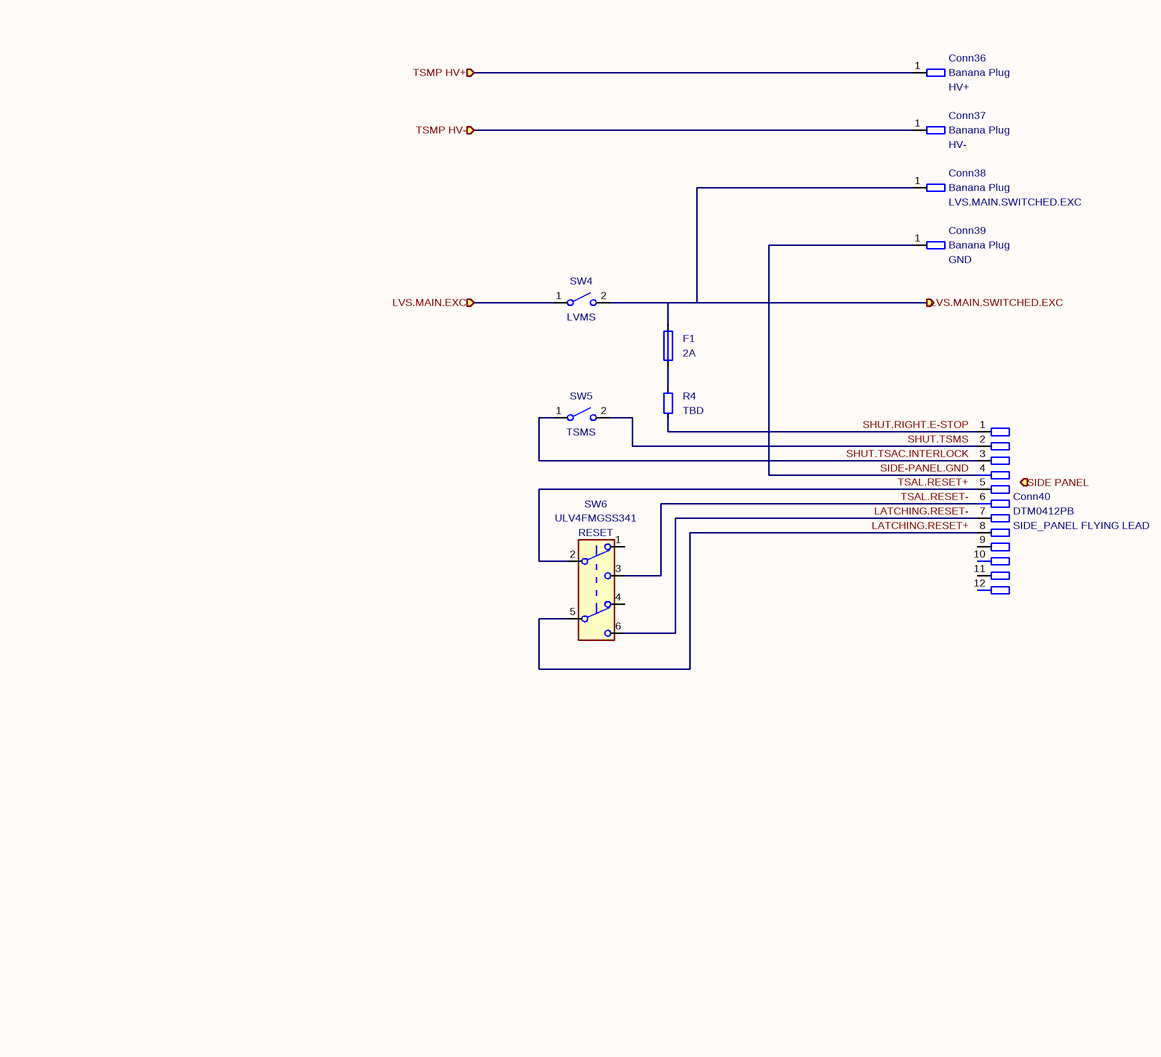
[diagram p60: loom-side-panel.SchDoc]

### Parts
(Parts that share a designator on the sheet are numbered #1, #2 ... from top to bottom, then left to right.)
Conn36#2  Connection Type: HV+  (hidden comment: Banana Plug)
Conn37#2  Connection Type: HV-  (hidden comment: Banana Plug)
Conn38#2  Connection Type: LVS.MAIN.SWITCHED.EXC  (hidden comment: Banana Plug)
Conn39#2  Connection Type: GND  (hidden comment: Banana Plug)
Conn40#2  P/N: DTM0412PB  Conn Name: SIDE_PANEL FLYING LEAD  (hidden comment: Deutsch_DTM_12P_Pin)
F1#2  2A
R4#2  TBD
SW4#3  LVMS
SW5#2  TSMS
SW6#2  Conn Name: RESET  (hidden comment: ULV4FMGSS341)

### Ports
LVS.MAIN.EXC (in), LVS.MAIN.SWITCHED.EXC (out), SIDE PANEL (in), TSMP HV+ (in), TSMP HV- (in)

### Nets
LATCHING.RESET+: Conn40#2.8 SW6#2.5(B)
LATCHING.RESET-: Conn40#2.7 SW6#2.6(C)
LVS.MAIN.EXC: SW4#3.1(A) ; port LVS.MAIN.EXC
LVS.MAIN.SWITCHED.EXC: Conn38#2.1 F1#2.1 SW4#3.2(B) ; port LVS.MAIN.SWITCHED.EXC
SHUT.RIGHT.E-STOP: Conn40#2.1 R4#2.2
SHUT.TSAC.INTERLOCK: Conn40#2.3 SW5#2.1(A)
SHUT.TSMS: Conn40#2.2 SW5#2.2(B)
SIDE-PANEL.GND: Conn39#2.1 Conn40#2.4
TSAL.RESET+: Conn40#2.5 SW6#2.2(B)
TSAL.RESET-: Conn40#2.6 SW6#2.3(C)
TSMP HV+: Conn36#2.1 ; port TSMP HV+
TSMP HV-: Conn37#2.1 ; port TSMP HV-
NetF1#2_2: F1#2.2 R4#2.1

Not connected (* = marked no-connect by the designer): Conn40#2 9 10 11 12; SW6#2 1(A) 4(A)

### Notes on the sheet
- 1
- 2
- 3
- 4
- 5
- 6
- A
- B
- C
- D
- Title: LOOM - SIDE PANEL
- File: loom-side-panel.kicad_sch
- Sheet: /
- KiCad E.D.A.  kicad (5.1.4)-1
- Size: A4
- Date:
- Rev:
- Id: 1/1

### Library data of the parts
F1#2 = Fuse: Value: 2A
R4#2 = R_Small: Value: TBD
SW4#3 SW5#2 = SW_SPST
  SW4#3: Value: LVMS
  SW5#2: Value: TSMS
SW6#2 = SW_Push_DPDT: Value: ULV4FMGSS341
Conn36#2 Conn37#2 Conn38#2 Conn39#2 = Banana Plug: Value: Banana Plug
Conn40#2 = Deutsch_DTM_12P_Pin: Value: Deutsch_DTM_12P_Pin

## Nets that join several sheets
+AIR.AUX.GND: loom-charging-cart (J1.3 SW11.1 SW11.3), loom-accumulator (6 pins), loom-umbilical-box (SW15.2 SW16.2 SW17.2)
LVS.MAIN.SWITCHED.EXC: loom-side-panel-right (Conn38#1.1 F2.1 F3.1 SW4#1.2), loom-rear-new (J19.1)
TSMP HV+: LOOM - HV BOX (R5.1), loom-side-panel-right (Conn36#1.1)
TSMP HV-: LOOM - HV BOX (R6.1), loom-side-panel-right (Conn37#1.1)